# EAGLE design toyotune_3s_lvc2 (EAGLE 5.11)

## Sheet 1 of 4
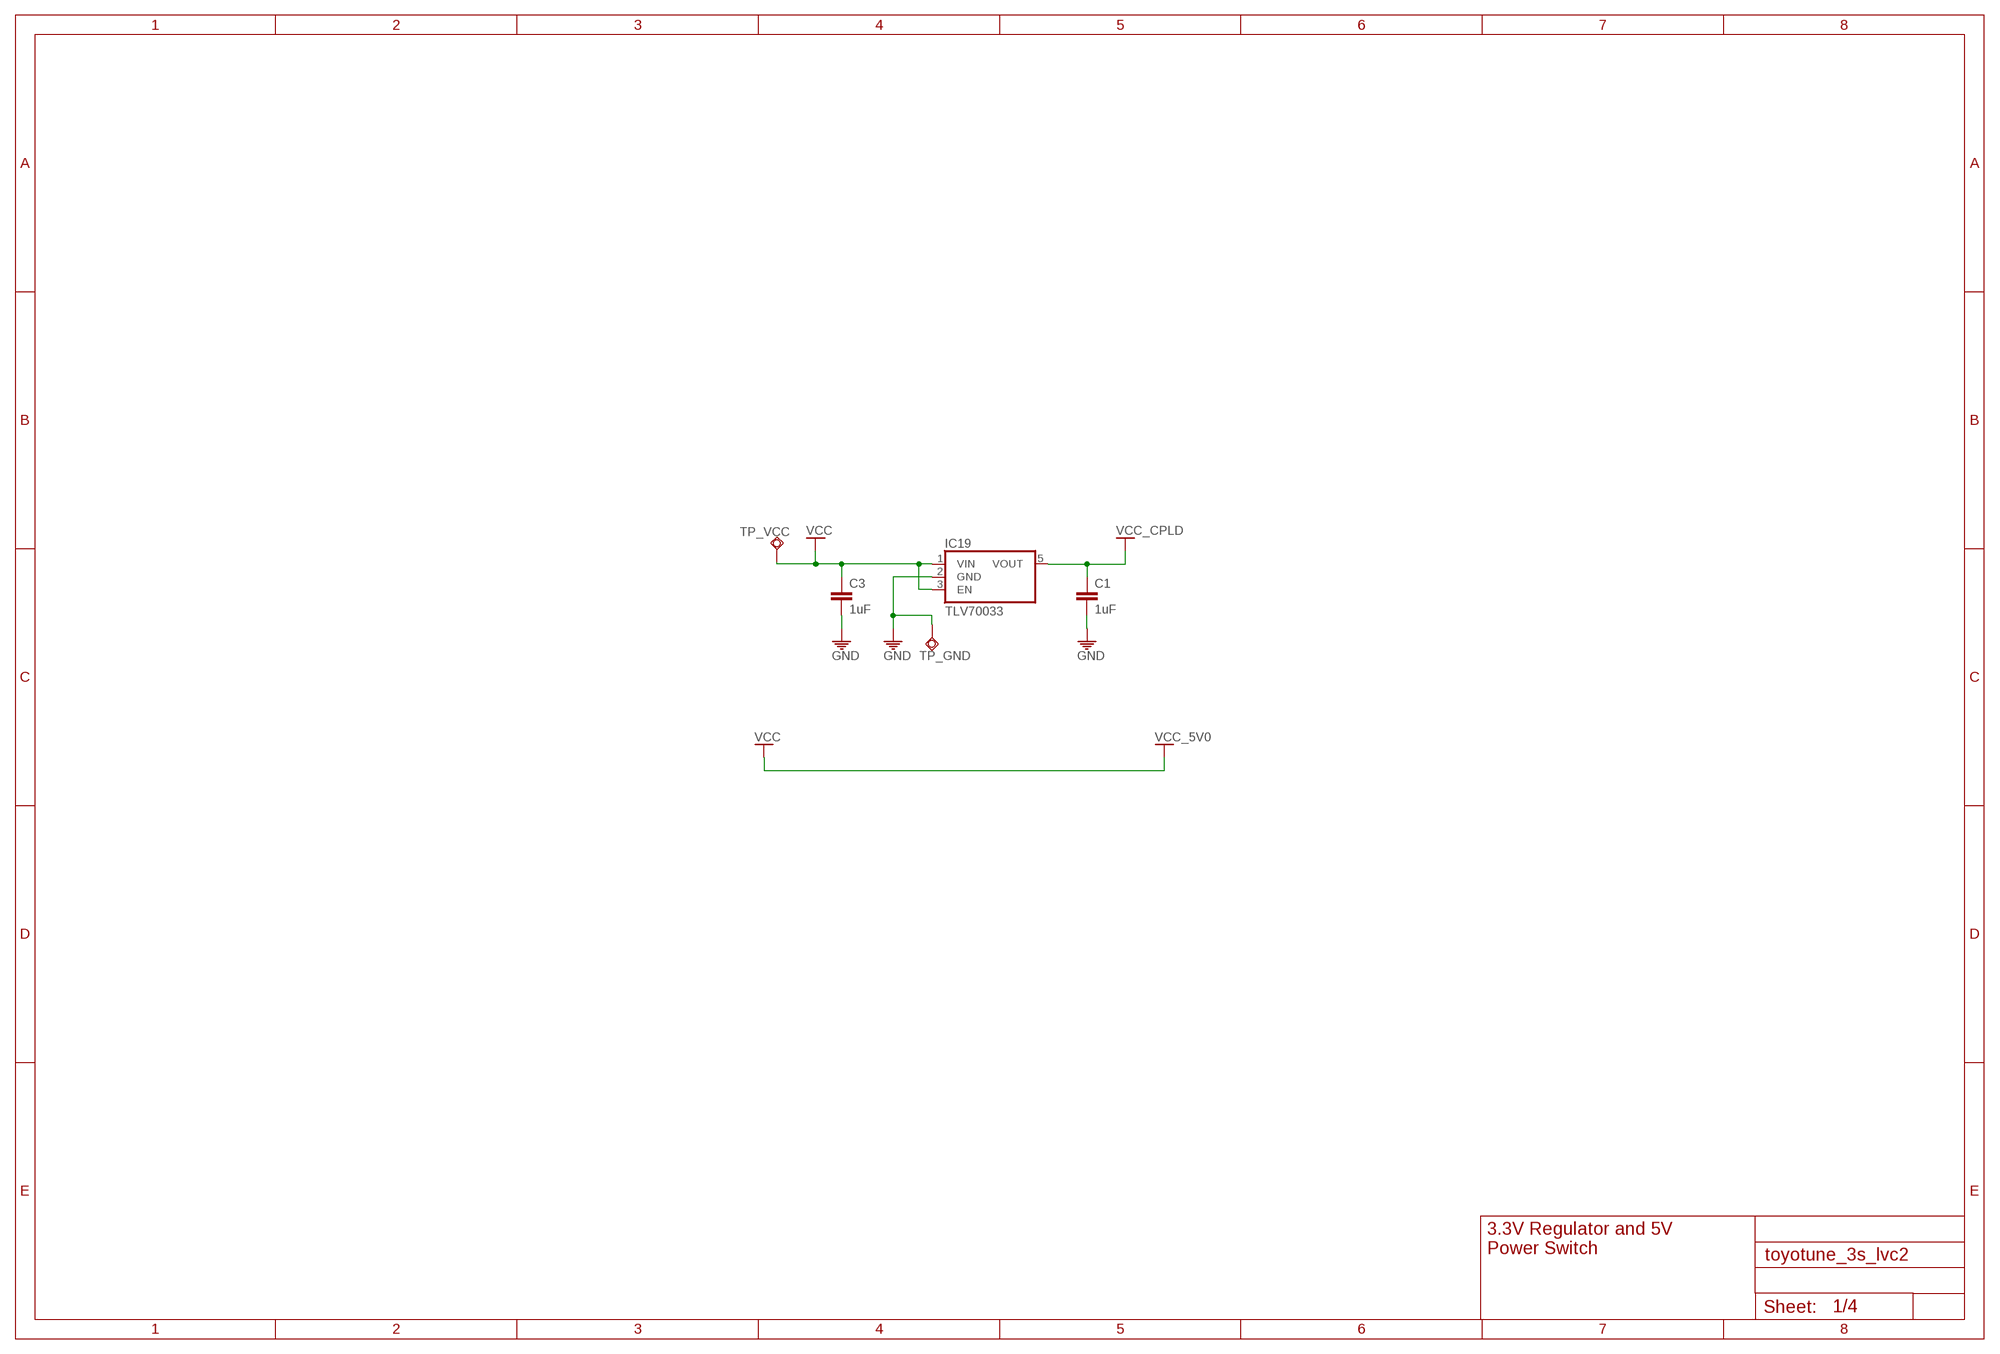
[diagram p0: schematic, sheet 1]

### Parts
C1  1uF  C-EUC0603  [C0603]
C3  1uF  C-EUC0603  [C0603]
IC19  TLV70033  [DDC_R-PDSO-G5]
TP_GND  TPSQTP12SQ  [TP12SQ]
TP_VCC  TPSQTP12SQ  [TP12SQ]

### Nets
GND: C1.2 C3.2 IC19.2(GND) TP_GND.TP ; also sheet 2,3,4
VCC: C3.1 IC19.1(VIN) IC19.3(EN) TP_VCC.TP ; supply symbol labelled VCC_5V0 ; also sheet 2,3,4
VCC_CPLD: C1.1 IC19.5(VOUT) ; also sheet 3,4

### Notes on the sheet
- 3.3V Regulator and 5V
- Power Switch

## Sheet 2 of 4
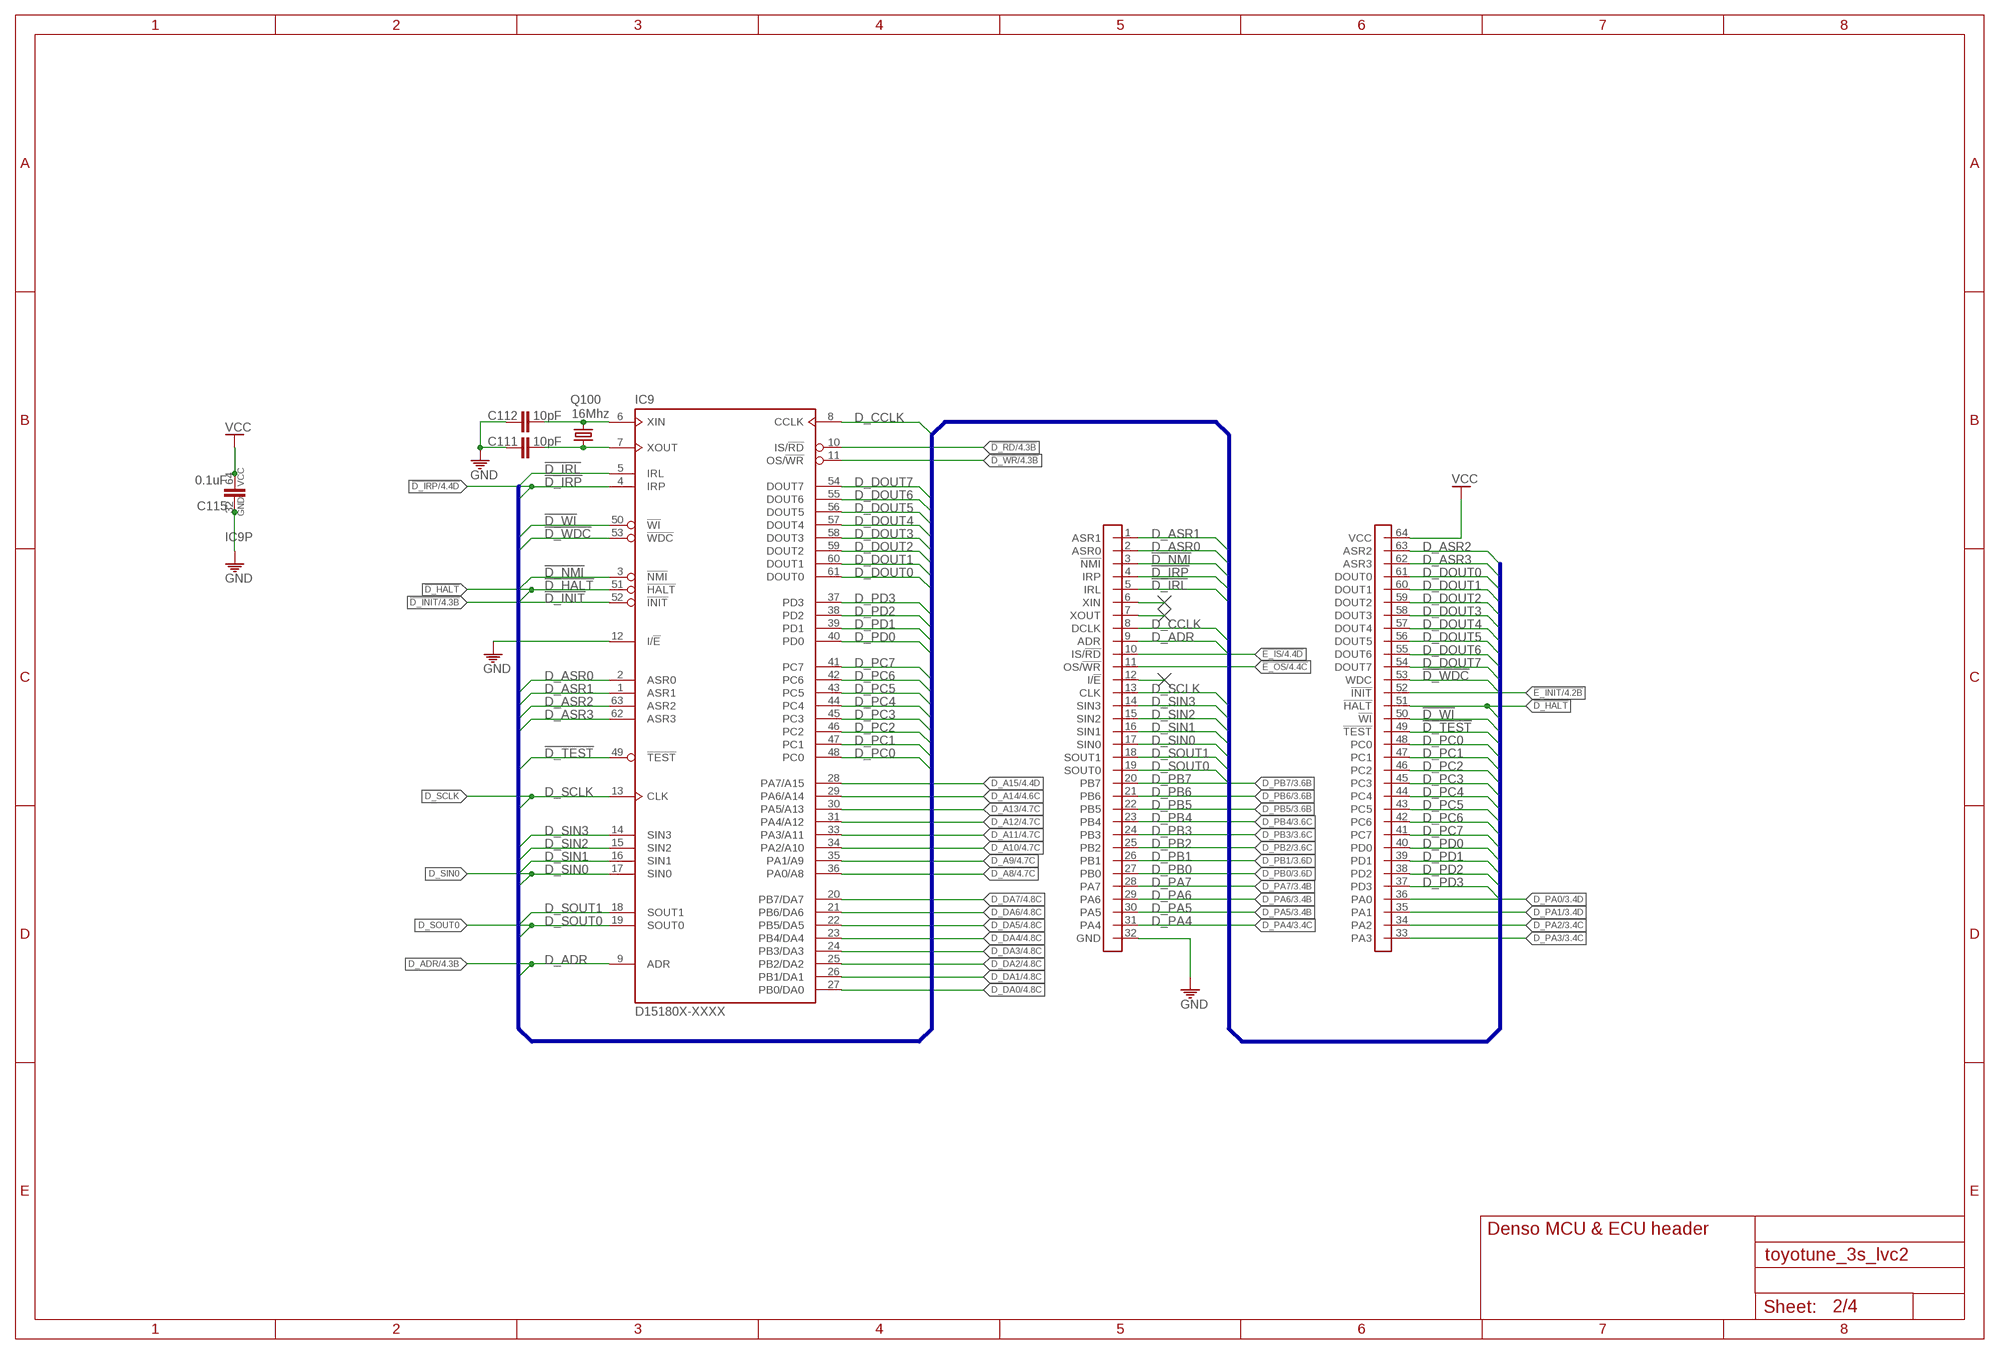
[diagram p1: schematic, sheet 2]

### Parts
C111  10pF  C-EUC0603  [C0603]
C112  10pF  C-EUC0603  [C0603]
C115  0.1uF  C-EUC0603  [C0603]
IC9  D15180X-XXXX  D151803-9661  [SDIP-64]
Q100  16Mhz  CRYSTAL5X3  [CRYSTAL-SMD-5X3]
U1  D151803-CONN  [SDIP-64-CONN]

### Nets
!D_HALT: IC9.51(:!HALT) U1.51(!HALT)
!D_INIT: IC9.52(:!INIT) ; also sheet 4
!D_IRL: IC9.5(:IRL) U1.5(IRL)
!D_IRP: IC9.4(:IRP) U1.4(IRP) ; also sheet 4
!D_NMI: IC9.3(:!NMI) U1.3(!NMI)
!D_RD: IC9.10(:IS/!RD) ; also sheet 4
!D_TEST: IC9.49(:!TEST) U1.49(!TEST)
!D_WDC: IC9.53(:!WDC) U1.53(WDC)
!D_WI: IC9.50(:!WI) U1.50(!WI)
!D_WR: IC9.11(:OS/!WR) ; also sheet 4
!E_INIT: U1.52(!INIT) ; also sheet 4
!E_IS: U1.10(IS/!RD) ; also sheet 4
!E_OS: U1.11(OS/!WR) ; also sheet 4
D1_XIN: C112.2 IC9.6(:XIN) Q100.3
D1_XOUT: C111.1 IC9.7(:XOUT) Q100.1
D_A8: IC9.36(:PA0/A8) ; also sheet 4
D_A9: IC9.35(:PA1/A9) ; also sheet 4
D_A10: IC9.34(:PA2/A10) ; also sheet 4
D_A11: IC9.33(:PA3/A11) ; also sheet 4
D_A12: IC9.31(:PA4/A12) ; also sheet 4
D_A13: IC9.30(:PA5/A13) ; also sheet 4
D_A14: IC9.29(:PA6/A14) ; also sheet 4
D_A15: IC9.28(:PA7/A15) ; also sheet 4
D_ADR: IC9.9(:ADR) U1.9(ADR) ; also sheet 4
D_ASR0: IC9.2(:ASR0) U1.2(ASR0)
D_ASR1: IC9.1(:ASR1) U1.1(ASR1)
D_ASR2: IC9.63(:ASR2) U1.63(ASR2)
D_ASR3: IC9.62(:ASR3) U1.62(ASR3)
D_CCLK: IC9.8(:CCLK) U1.8(DCLK) ; also sheet 4
D_DA0: IC9.27(:PB0/DA0) ; also sheet 4
D_DA1: IC9.26(:PB1/DA1) ; also sheet 4
D_DA2: IC9.25(:PB2/DA2) ; also sheet 4
D_DA3: IC9.24(:PB3/DA3) ; also sheet 4
D_DA4: IC9.23(:PB4/DA4) ; also sheet 4
D_DA5: IC9.22(:PB5/DA5) ; also sheet 4
D_DA6: IC9.21(:PB6/DA6) ; also sheet 4
D_DA7: IC9.20(:PB7/DA7) ; also sheet 4
D_DOUT0: IC9.61(:DOUT0) U1.61(DOUT0)
D_DOUT1: IC9.60(:DOUT1) U1.60(DOUT1)
D_DOUT2: IC9.59(:DOUT2) U1.59(DOUT2)
D_DOUT3: IC9.58(:DOUT3) U1.58(DOUT3)
D_DOUT4: IC9.57(:DOUT4) U1.57(DOUT4)
D_DOUT5: IC9.56(:DOUT5) U1.56(DOUT5)
D_DOUT6: IC9.55(:DOUT6) U1.55(DOUT6)
D_DOUT7: IC9.54(:DOUT7) U1.54(DOUT7)
D_PA0: U1.36(PA0) ; also sheet 3
D_PA1: U1.35(PA1) ; also sheet 3
D_PA2: U1.34(PA2) ; also sheet 3
D_PA3: U1.33(PA3) ; also sheet 3
D_PA4: U1.31(PA4) ; also sheet 3
D_PA5: U1.30(PA5) ; also sheet 3
D_PA6: U1.29(PA6) ; also sheet 3
D_PA7: U1.28(PA7) ; also sheet 3
D_PB0: U1.27(PB0) ; also sheet 3
D_PB1: U1.26(PB1) ; also sheet 3
D_PB2: U1.25(PB2) ; also sheet 3
D_PB3: U1.24(PB3) ; also sheet 3
D_PB4: U1.23(PB4) ; also sheet 3
D_PB5: U1.22(PB5) ; also sheet 3
D_PB6: U1.21(PB6) ; also sheet 3
D_PB7: U1.20(PB7) ; also sheet 3
D_PC0: IC9.48(:PC0) U1.48(PC0)
D_PC1: IC9.47(:PC1) U1.47(PC1)
D_PC2: IC9.46(:PC2) U1.46(PC2)
D_PC3: IC9.45(:PC3) U1.45(PC3)
D_PC4: IC9.44(:PC4) U1.44(PC4)
D_PC5: IC9.43(:PC5) U1.43(PC5)
D_PC6: IC9.42(:PC6) U1.42(PC6)
D_PC7: IC9.41(:PC7) U1.41(PC7)
D_PD0: IC9.40(:PD0) U1.40(PD0)
D_PD1: IC9.39(:PD1) U1.39(PD1)
D_PD2: IC9.38(:PD2) U1.38(PD2)
D_PD3: IC9.37(:PD3) U1.37(PD3)
D_SCLK: IC9.13(:CLK) U1.13(CLK)
D_SIN0: IC9.17(:SIN0) U1.17(SIN0)
D_SIN1: IC9.16(:SIN1) U1.16(SIN1)
D_SIN2: IC9.15(:SIN2) U1.15(SIN2)
D_SIN3: IC9.14(:SIN3) U1.14(SIN3)
D_SOUT0: IC9.19(:SOUT0) U1.19(SOUT0)
D_SOUT1: IC9.18(:SOUT1) U1.18(SOUT1)
GND: C111.2 C112.1 C115.1 IC9.12(:I/!E) IC9.32(P:GND) U1.32(GND) ; also sheet 1,3,4
N$28: U1.6(XIN)
N$29: U1.7(XOUT)
N$30: U1.12(I/!E)
VCC: C115.2 IC9.64(P:VCC) U1.64(VCC) ; also sheet 1,3,4

### Buses
!D_IRL,!D_IRP,!D_WI,!D_WDC,!D_NMI,!D_HALT,!D1_INIT,D_ASR[0..3],!D_TEST,D_PC[0..7],D_PD[0..3],D_ADR,D_SIN[0..3],D_SOUT[0..1],D_SCLK,D_CCLK,D_DOUT[0..7]

### Notes on the sheet
- Denso MCU & ECU header

## Sheet 3 of 4
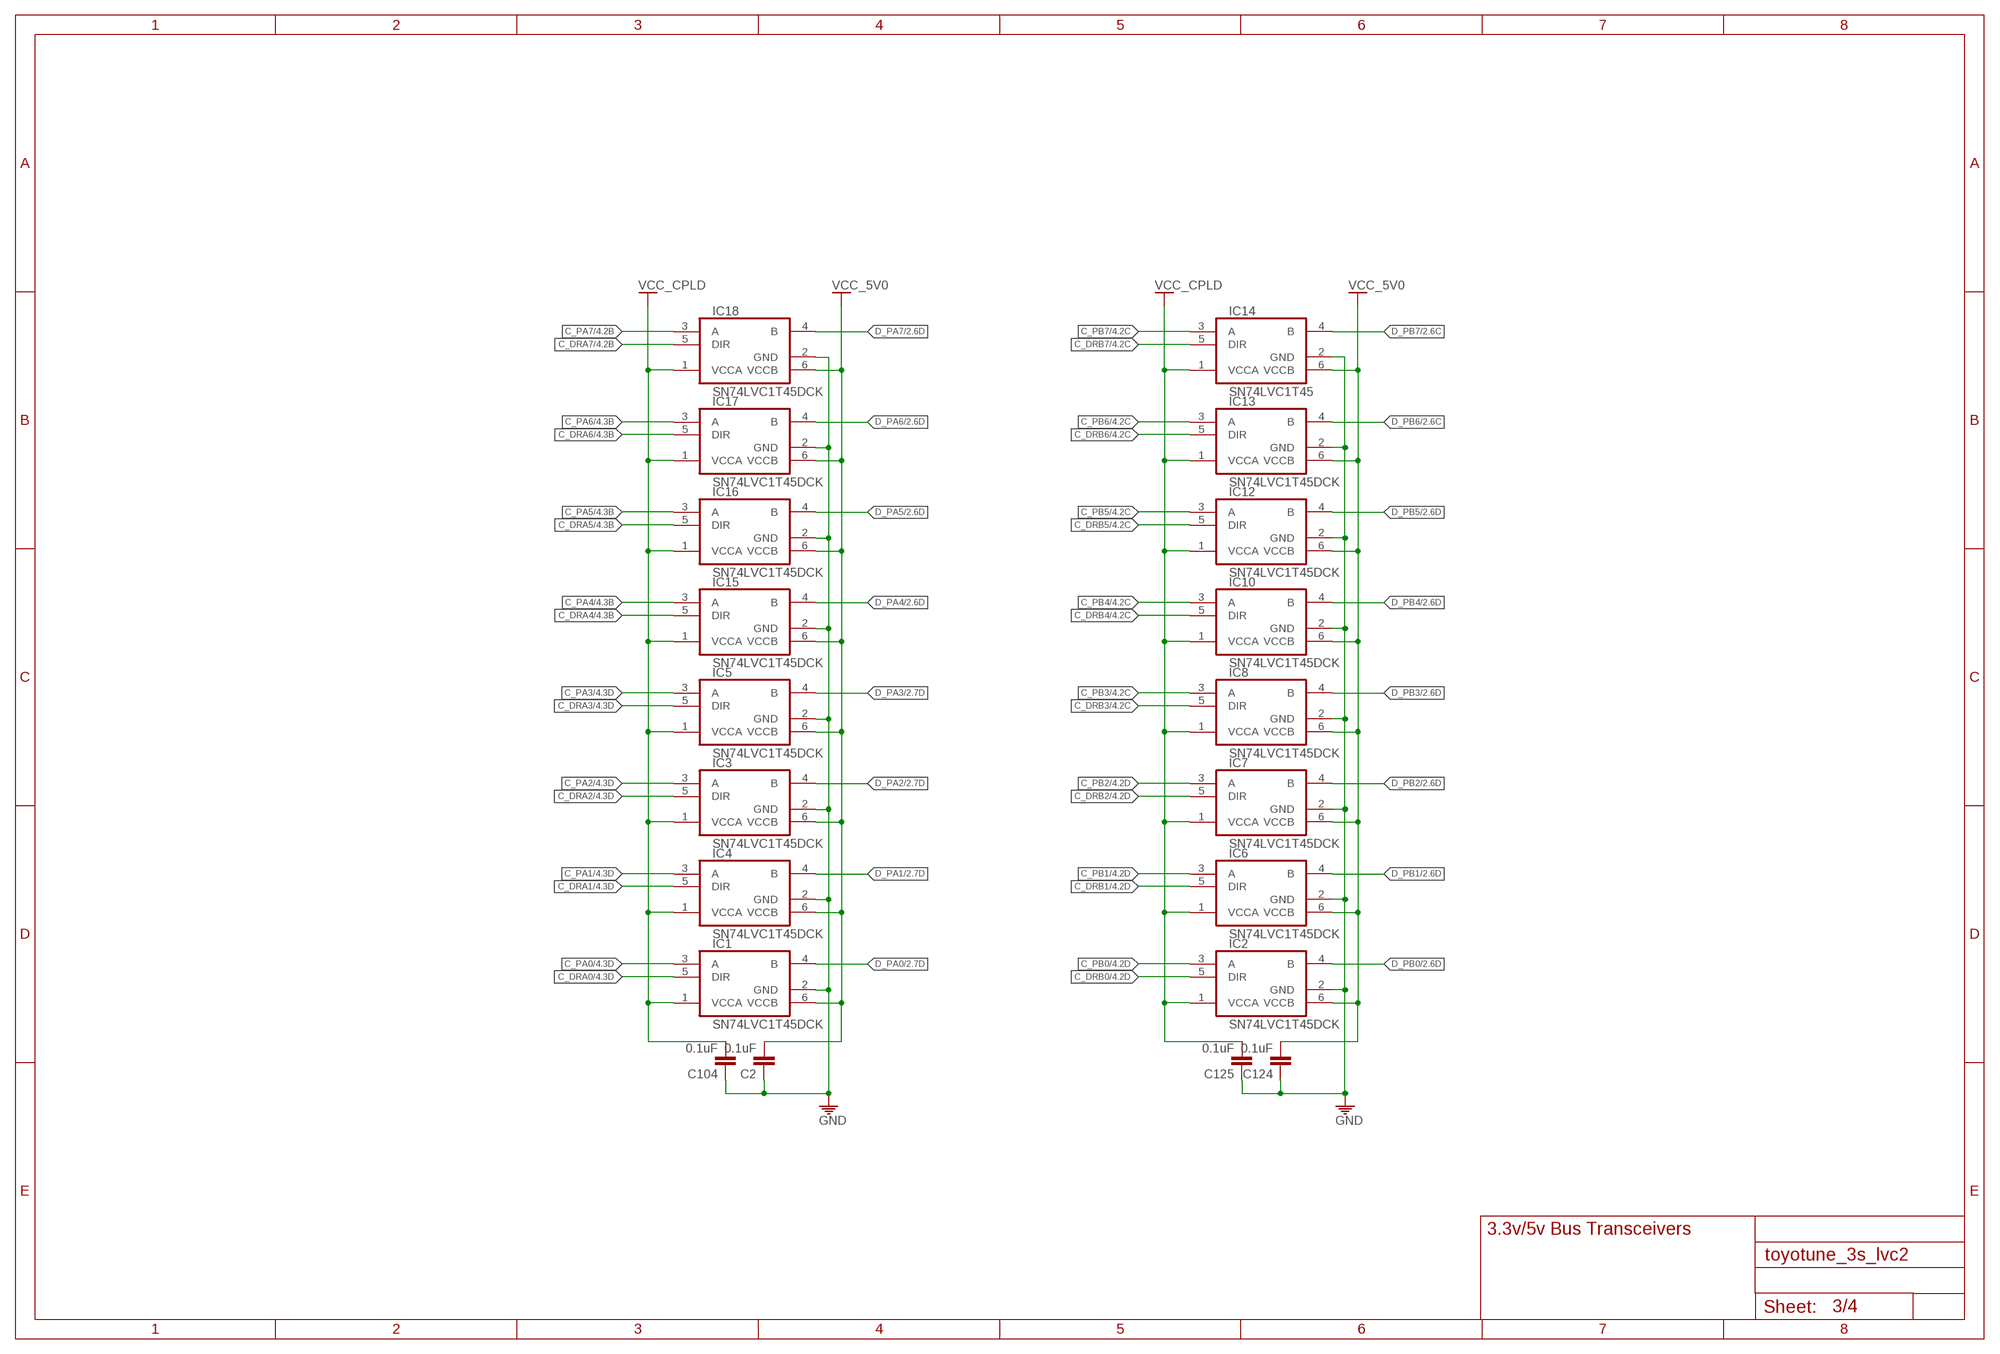
[diagram p2: schematic, sheet 3]

### Parts
C2  0.1uF  C-EUC0603  [C0603]
C104  0.1uF  C-EUC0603  [C0603]
C124  0.1uF  C-EUC0603  [C0603]
C125  0.1uF  C-EUC0603  [C0603]
IC1  SN74LVC1T45DCK  [DCK_R-PDSO-G6]
IC2  SN74LVC1T45DCK  [DCK_R-PDSO-G6]
IC3  SN74LVC1T45DCK  [DCK_R-PDSO-G6]
IC4  SN74LVC1T45DCK  [DCK_R-PDSO-G6]
IC5  SN74LVC1T45DCK  [DCK_R-PDSO-G6]
IC6  SN74LVC1T45DCK  [DCK_R-PDSO-G6]
IC7  SN74LVC1T45DCK  [DCK_R-PDSO-G6]
IC8  SN74LVC1T45DCK  [DCK_R-PDSO-G6]
IC10  SN74LVC1T45DCK  [DCK_R-PDSO-G6]
IC12  SN74LVC1T45DCK  [DCK_R-PDSO-G6]
IC13  SN74LVC1T45DCK  [DCK_R-PDSO-G6]
IC14  SN74LVC1T45  SN74LVC1T45DCK  [DCK_R-PDSO-G6]
IC15  SN74LVC1T45DCK  [DCK_R-PDSO-G6]
IC16  SN74LVC1T45DCK  [DCK_R-PDSO-G6]
IC17  SN74LVC1T45DCK  [DCK_R-PDSO-G6]
IC18  SN74LVC1T45DCK  [DCK_R-PDSO-G6]

### Nets
C_DRA0: IC1.5(DIR) ; also sheet 4
C_DRA1: IC4.5(DIR) ; also sheet 4
C_DRA2: IC3.5(DIR) ; also sheet 4
C_DRA3: IC5.5(DIR) ; also sheet 4
C_DRA4: IC15.5(DIR) ; also sheet 4
C_DRA5: IC16.5(DIR) ; also sheet 4
C_DRA6: IC17.5(DIR) ; also sheet 4
C_DRA7: IC18.5(DIR) ; also sheet 4
C_DRB0: IC2.5(DIR) ; also sheet 4
C_DRB1: IC6.5(DIR) ; also sheet 4
C_DRB2: IC7.5(DIR) ; also sheet 4
C_DRB3: IC8.5(DIR) ; also sheet 4
C_DRB4: IC10.5(DIR) ; also sheet 4
C_DRB5: IC12.5(DIR) ; also sheet 4
C_DRB6: IC13.5(DIR) ; also sheet 4
C_DRB7: IC14.5(DIR) ; also sheet 4
C_PA0: IC1.3(A) ; also sheet 4
C_PA1: IC4.3(A) ; also sheet 4
C_PA2: IC3.3(A) ; also sheet 4
C_PA3: IC5.3(A) ; also sheet 4
C_PA4: IC15.3(A) ; also sheet 4
C_PA5: IC16.3(A) ; also sheet 4
C_PA6: IC17.3(A) ; also sheet 4
C_PA7: IC18.3(A) ; also sheet 4
C_PB0: IC2.3(A) ; also sheet 4
C_PB1: IC6.3(A) ; also sheet 4
C_PB2: IC7.3(A) ; also sheet 4
C_PB3: IC8.3(A) ; also sheet 4
C_PB4: IC10.3(A) ; also sheet 4
C_PB5: IC12.3(A) ; also sheet 4
C_PB6: IC13.3(A) ; also sheet 4
C_PB7: IC14.3(A) ; also sheet 4
D_PA0: IC1.4(B) ; also sheet 2
D_PA1: IC4.4(B) ; also sheet 2
D_PA2: IC3.4(B) ; also sheet 2
D_PA3: IC5.4(B) ; also sheet 2
D_PA4: IC15.4(B) ; also sheet 2
D_PA5: IC16.4(B) ; also sheet 2
D_PA6: IC17.4(B) ; also sheet 2
D_PA7: IC18.4(B) ; also sheet 2
D_PB0: IC2.4(B) ; also sheet 2
D_PB1: IC6.4(B) ; also sheet 2
D_PB2: IC7.4(B) ; also sheet 2
D_PB3: IC8.4(B) ; also sheet 2
D_PB4: IC10.4(B) ; also sheet 2
D_PB5: IC12.4(B) ; also sheet 2
D_PB6: IC13.4(B) ; also sheet 2
D_PB7: IC14.4(B) ; also sheet 2
GND: C2.1 C104.1 C124.1 C125.1 IC1.2(GND) IC2.2(GND) IC3.2(GND) IC4.2(GND) IC5.2(GND) IC6.2(GND) IC7.2(GND) IC8.2(GND) IC10.2(GND) IC12.2(GND) IC13.2(GND) IC14.2(GND) IC15.2(GND) IC16.2(GND) IC17.2(GND) IC18.2(GND) ; also sheet 1,2,4
VCC: C2.2 C124.2 IC1.6(VCCB) IC2.6(VCCB) IC3.6(VCCB) IC4.6(VCCB) IC5.6(VCCB) IC6.6(VCCB) IC7.6(VCCB) IC8.6(VCCB) IC10.6(VCCB) IC12.6(VCCB) IC13.6(VCCB) IC14.6(VCCB) IC15.6(VCCB) IC16.6(VCCB) IC17.6(VCCB) IC18.6(VCCB) ; supply symbol labelled VCC_5V0 ; also sheet 1,2,4
VCC_CPLD: C104.2 C125.2 IC1.1(VCCA) IC2.1(VCCA) IC3.1(VCCA) IC4.1(VCCA) IC5.1(VCCA) IC6.1(VCCA) IC7.1(VCCA) IC8.1(VCCA) IC10.1(VCCA) IC12.1(VCCA) IC13.1(VCCA) IC14.1(VCCA) IC15.1(VCCA) IC16.1(VCCA) IC17.1(VCCA) IC18.1(VCCA) ; also sheet 1,4

### Notes on the sheet
- 3.3v/5v Bus Transceivers

## Sheet 4 of 4
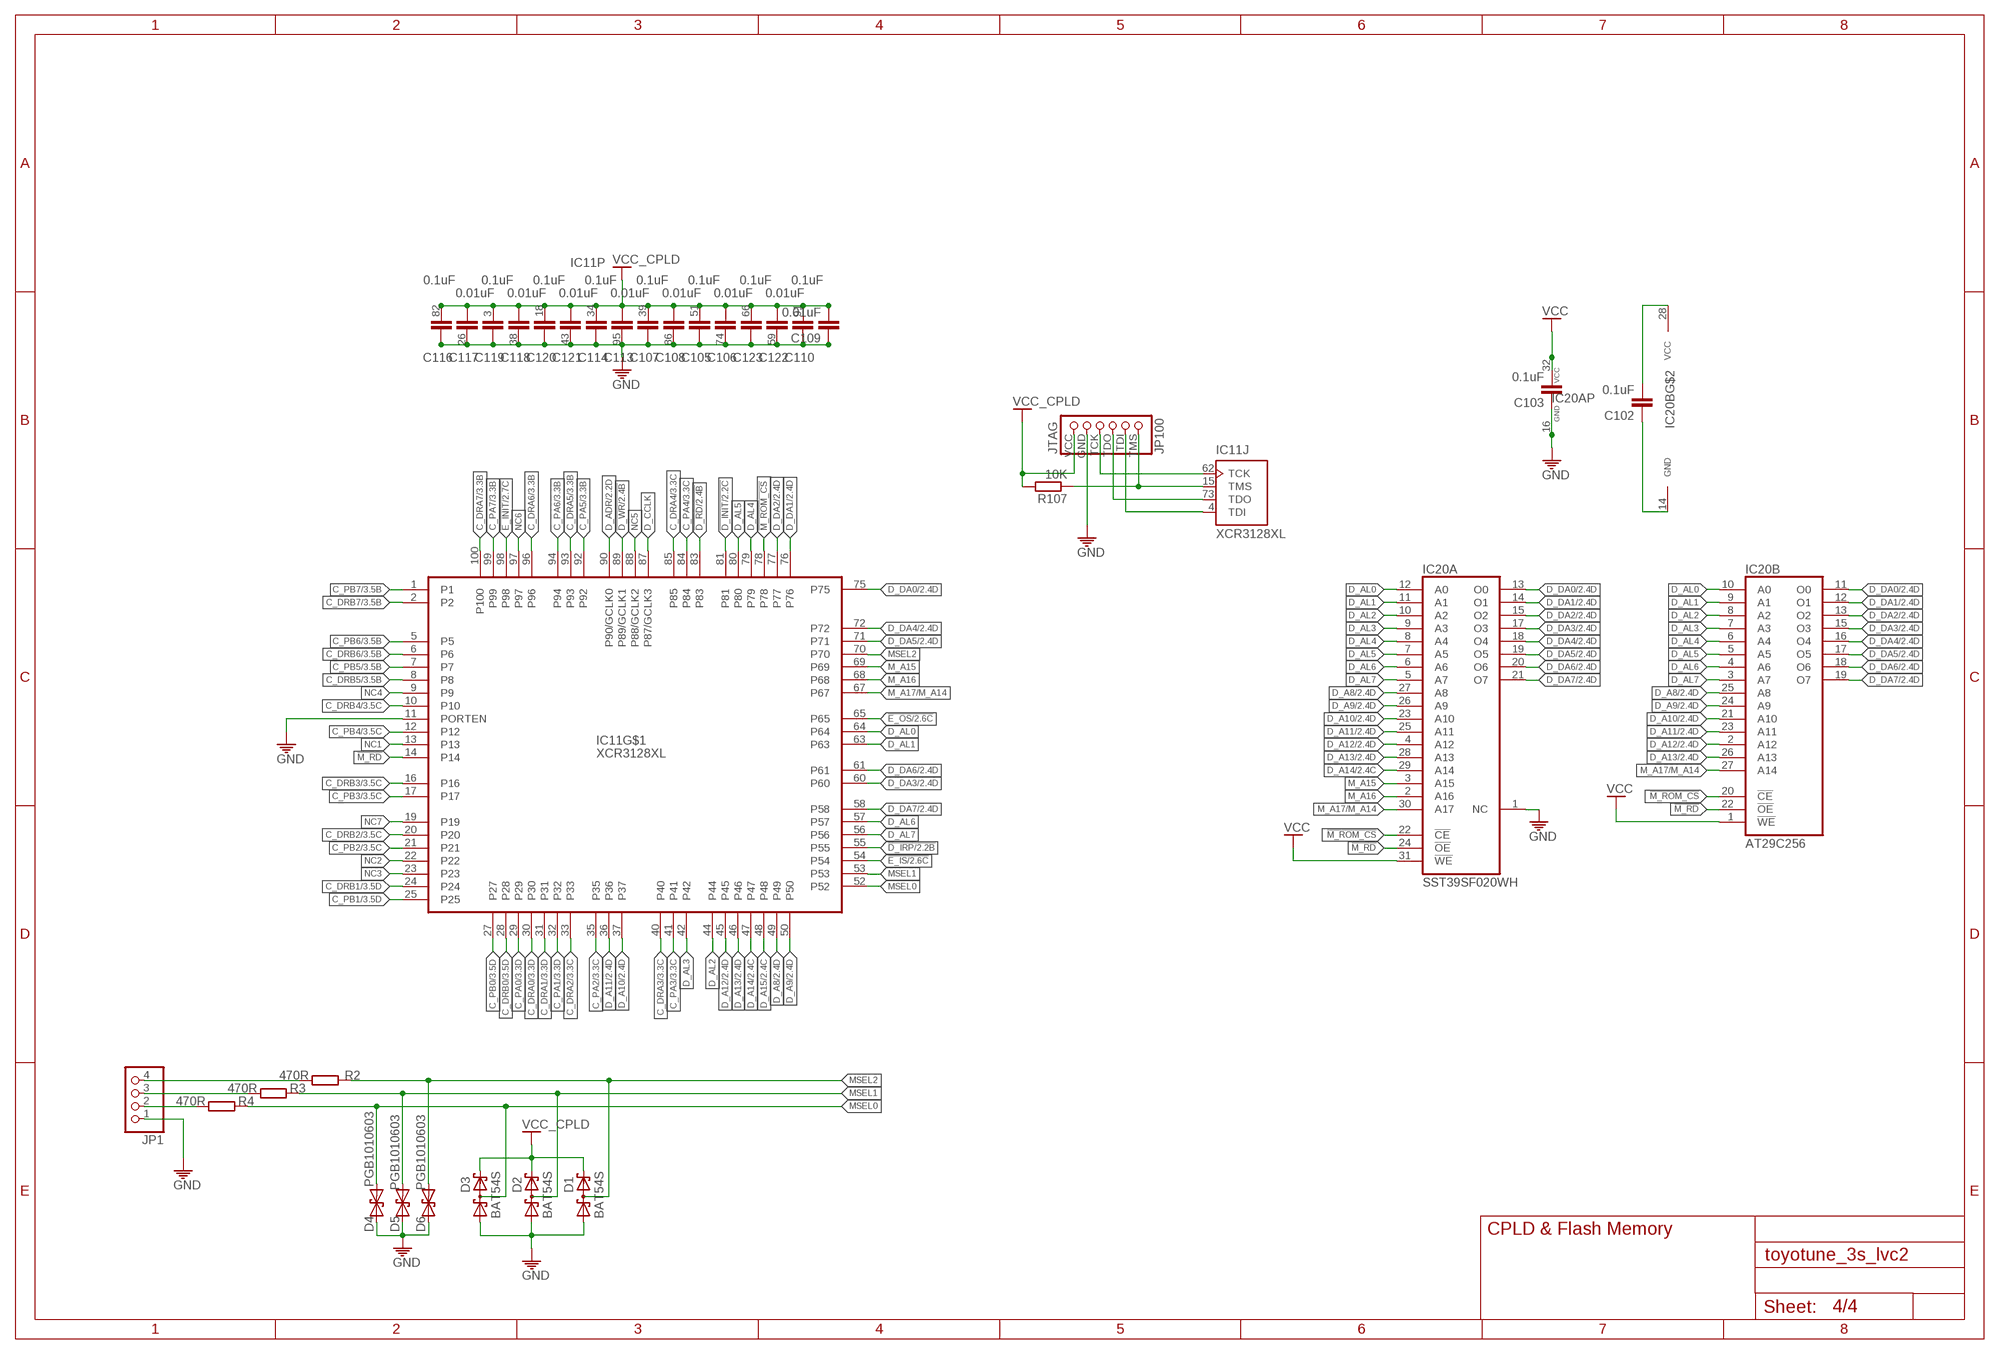
[diagram p3: schematic, sheet 4]

### Parts
C102  0.1uF  C-EUC0603  [C0603]
C103  0.1uF  C-EUC0603  [C0603]
C105  0.1uF  C-EUC0603  [C0603]
C106  0.01uF  C-EUC0603  [C0603]
C107  0.1uF  C-EUC0603  [C0603]
C108  0.01uF  C-EUC0603  [C0603]
C109  0.01uF  C-EUC0603  [C0603]
C110  0.1uF  C-EUC0603  [C0603]
C113  0.01uF  C-EUC0603  [C0603]
C114  0.1uF  C-EUC0603  [C0603]
C116  0.1uF  C-EUC0603  [C0603]
C117  0.01uF  C-EUC0603  [C0603]
C118  0.01uF  C-EUC0603  [C0603]
C119  0.1uF  C-EUC0603  [C0603]
C120  0.1uF  C-EUC0603  [C0603]
C121  0.01uF  C-EUC0603  [C0603]
C122  0.01uF  C-EUC0603  [C0603]
C123  0.1uF  C-EUC0603  [C0603]
D1  BAT54S  [SOT23]
D2  BAT54S  [SOT23]
D3  BAT54S  [SOT23]
D4  PGB1010603  [R0603]
D5  PGB1010603  [R0603]
D6  PGB1010603  [R0603]
IC11  XCR3128XL  [VQ100]
IC20A  SST39SF020WH  SST39VF020NH2  [S32]
IC20B  AT29C256  [PDIP28]
JP1  PINHD-1X4  [1X04]
JP100  JTAG  JTAG_HEADERS  [1X06_SMD]
R2  470R  R-EU_R0603  [R0603]
R3  470R  R-EU_R0603  [R0603]
R4  470R  R-EU_R0603  [R0603]
R107  10K  R-EU_R0603  [R0603]

### Nets
!D_INIT: IC11.81 ; also sheet 2
!D_IRP: IC11.55 ; also sheet 2
!D_RD: IC11.83 ; also sheet 2
!D_WR: IC11.89(P89/GCLK1) ; also sheet 2
!E_INIT: IC11.98 ; also sheet 2
!E_IS: IC11.54 ; also sheet 2
!E_OS: IC11.65 ; also sheet 2
!M_RD: IC11.14 IC20A.24(!OE) IC20B.22(!OE)
!M_ROM_CS: IC11.78 IC20A.22(!CE) IC20B.20(!CE)
C_DRA0: IC11.30 ; also sheet 3
C_DRA1: IC11.31 ; also sheet 3
C_DRA2: IC11.33 ; also sheet 3
C_DRA3: IC11.40 ; also sheet 3
C_DRA4: IC11.85 ; also sheet 3
C_DRA5: IC11.93 ; also sheet 3
C_DRA6: IC11.96 ; also sheet 3
C_DRA7: IC11.100 ; also sheet 3
C_DRB0: IC11.28 ; also sheet 3
C_DRB1: IC11.24 ; also sheet 3
C_DRB2: IC11.20 ; also sheet 3
C_DRB3: IC11.16 ; also sheet 3
C_DRB4: IC11.10 ; also sheet 3
C_DRB5: IC11.8 ; also sheet 3
C_DRB6: IC11.6 ; also sheet 3
C_DRB7: IC11.2 ; also sheet 3
C_PA0: IC11.29 ; also sheet 3
C_PA1: IC11.32 ; also sheet 3
C_PA2: IC11.35 ; also sheet 3
C_PA3: IC11.41 ; also sheet 3
C_PA4: IC11.84 ; also sheet 3
C_PA5: IC11.92 ; also sheet 3
C_PA6: IC11.94 ; also sheet 3
C_PA7: IC11.99 ; also sheet 3
C_PB0: IC11.27 ; also sheet 3
C_PB1: IC11.25 ; also sheet 3
C_PB2: IC11.21 ; also sheet 3
C_PB3: IC11.17 ; also sheet 3
C_PB4: IC11.12 ; also sheet 3
C_PB5: IC11.7 ; also sheet 3
C_PB6: IC11.5 ; also sheet 3
C_PB7: IC11.1 ; also sheet 3
D_A8: IC11.49 IC20A.27(A8) IC20B.25(A8) ; also sheet 2
D_A9: IC11.50 IC20A.26(A9) IC20B.24(A9) ; also sheet 2
D_A10: IC11.37 IC20A.23(A10) IC20B.21(A10) ; also sheet 2
D_A11: IC11.36 IC20A.25(A11) IC20B.23(A11) ; also sheet 2
D_A12: IC11.45 IC20A.4(A12) IC20B.2(A12) ; also sheet 2
D_A13: IC11.46 IC20A.28(A13) IC20B.26(A13) ; also sheet 2
D_A14: IC11.47 IC20A.29(A14) ; also sheet 2
D_A15: IC11.48 ; also sheet 2
D_ADR: IC11.90(P90/GCLK0) ; also sheet 2
D_AL0: IC11.64 IC20A.12(A0) IC20B.10(A0)
D_AL1: IC11.63 IC20A.11(A1) IC20B.9(A1)
D_AL2: IC11.44 IC20A.10(A2) IC20B.8(A2)
D_AL3: IC11.42 IC20A.9(A3) IC20B.7(A3)
D_AL4: IC11.79 IC20A.8(A4) IC20B.6(A4)
D_AL5: IC11.80 IC20A.7(A5) IC20B.5(A5)
D_AL6: IC11.57 IC20A.6(A6) IC20B.4(A6)
D_AL7: IC11.56 IC20A.5(A7) IC20B.3(A7)
D_CCLK: IC11.87(P87/GCLK3) ; also sheet 2
D_DA0: IC11.75 IC20A.13(O0) IC20B.11(O0) ; also sheet 2
D_DA1: IC11.76 IC20A.14(O1) IC20B.12(O1) ; also sheet 2
D_DA2: IC11.77 IC20A.15(O2) IC20B.13(O2) ; also sheet 2
D_DA3: IC11.60 IC20A.17(O3) IC20B.15(O3) ; also sheet 2
D_DA4: IC11.72 IC20A.18(O4) IC20B.16(O4) ; also sheet 2
D_DA5: IC11.71 IC20A.19(O5) IC20B.17(O5) ; also sheet 2
D_DA6: IC11.61 IC20A.20(O6) IC20B.18(O6) ; also sheet 2
D_DA7: IC11.58 IC20A.21(O7) IC20B.19(O7) ; also sheet 2
GND: C102.1 C103.1 C105.1 C106.1 C107.1 C108.1 C109.1 C110.1 C113.1 C114.1 C116.1 C117.1 C118.1 C119.1 C120.1 C121.1 C122.1 C123.1 D1.1(A1) D2.1(A1) D3.1(A1) D4.1 D5.1 D6.1 IC11.11(PORTEN) IC11.26(P:GND) IC11.38(P:GND) IC11.43(P:GND) IC11.59(P:GND) IC11.74(P:GND) IC11.86(P:GND) IC11.95(P:GND) IC20A.1(NC) IC20A.16(GND) IC20B.14(GND) JP1.1 JP100.GND ; also sheet 1,2,3
M_A15: IC11.69 IC20A.3(A15)
M_A16: IC11.68 IC20A.2(A16)
M_A17/M_A14: IC11.67 IC20A.30(A17) IC20B.27(A14)
MSEL0: D3.3(C1A2) D4.2 IC11.52 R4.1
MSEL0_ECU: JP1.2 R4.2
MSEL1: D2.3(C1A2) D5.2 IC11.53 R3.1
MSEL1_ECU: JP1.3 R3.2
MSEL2: D1.3(C1A2) D6.2 IC11.70 R2.1
MSEL2_ECU: JP1.4 R2.2
NC1: IC11.13
NC2: IC11.22
NC3: IC11.23
NC4: IC11.9
NC5: IC11.88(P88/GCLK2)
NC6: IC11.97
NC7: IC11.19
TCK: IC11.62(J:TCK) JP100.TCK
TDI: IC11.4(J:TDI) JP100.TDI
TDO: IC11.73(J:TDO) JP100.TDO
TMS: IC11.15(J:TMS) JP100.TMS R107.1
VCC: C102.2 C103.2 IC20A.31(!WE) IC20A.32(VCC) IC20B.1(!WE) IC20B.28(VCC) ; also sheet 1,2,3
VCC_CPLD: C105.2 C106.2 C107.2 C108.2 C109.2 C110.2 C113.2 C114.2 C116.2 C117.2 C118.2 C119.2 C120.2 C121.2 C122.2 C123.2 D1.2(C2) D2.2(C2) D3.2(C2) IC11.3(P:VCC_3V3) IC11.18(P:VCC_3V3) IC11.34(P:VCC_3V3) IC11.39(P:VCC_3V3) IC11.51(P:VCC_3V3) IC11.66(P:VCC_3V3) IC11.82(P:VCC_3V3) IC11.91(P:VCC_3V3) JP100.VCC R107.2 ; also sheet 1,3

### Notes on the sheet
- CPLD & Flash Memory

## Library data of the parts
C1-C3 C102-C125 = toyotune:C-EU: CAPACITOR, European symbol
D1-D3 = toyotune:BAT54S: Schottky Diodes Source: Fairchild .. BAT54.pdf
D4-D6 = toyotune:PGB1010603
IC1-IC8 IC10 IC12-IC18 = toyotune:SN74LVC1T45
IC9 = toyota-ecu:D151803-9661
IC11 = toyota-ecu:XCR3128XL
IC19 = toyota-ecu:TLV70033
IC20A = toyotune:SST39VF020: 2-Megabit FLASH MEMORY (256 K x 8 bit) 2.7-3.6 V
IC20B = toyotune:AT29C256
JP1 = toyotune:PINHD-1X4: PIN HEADER
JP100 = toyotune:JTAG_HEADER: PIN HEADER
Q100 = toyota-ecu:CRYSTAL: Crystals Various standard crystals. Proven footprints. Spark Fun Electronics SKU : COM-00534
R2-R4 R107 = toyotune:R-EU_: RESISTOR, European symbol
TP_GND TP_VCC = testpad:TPSQ: Test pad
U1 = toyotune:D151803-CONN

## Board
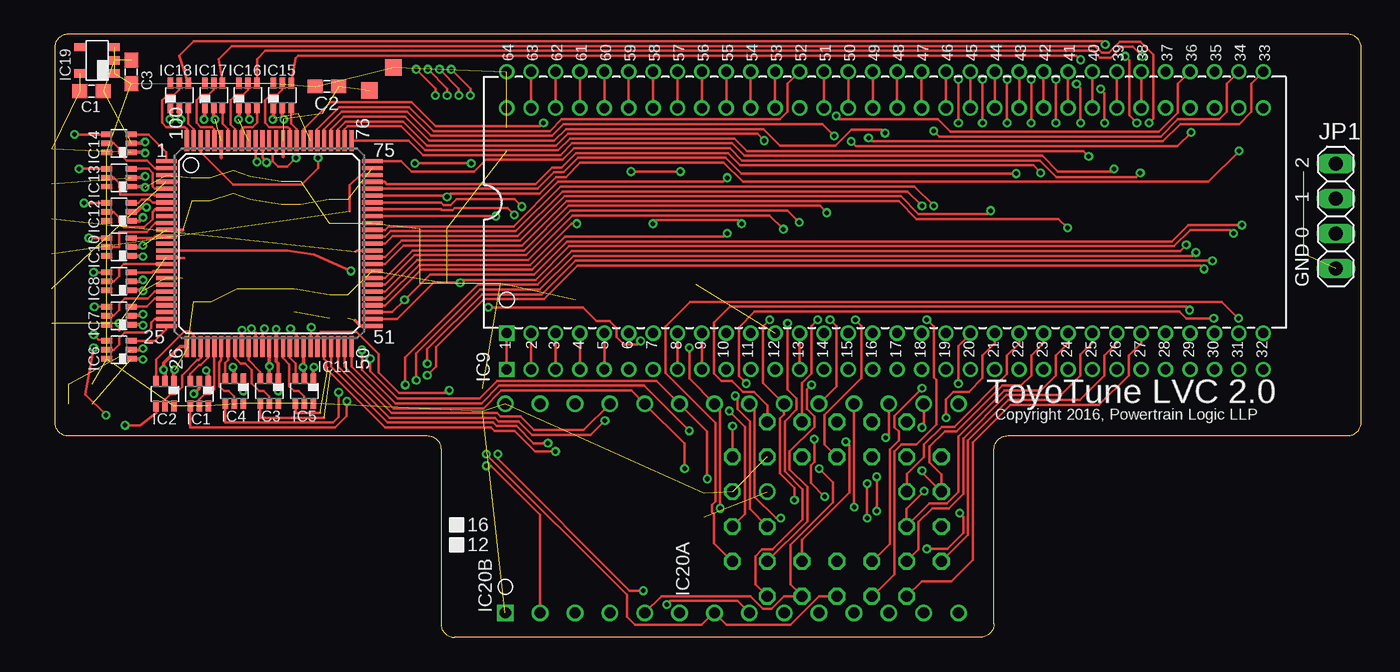
[diagram p4: board, top side]
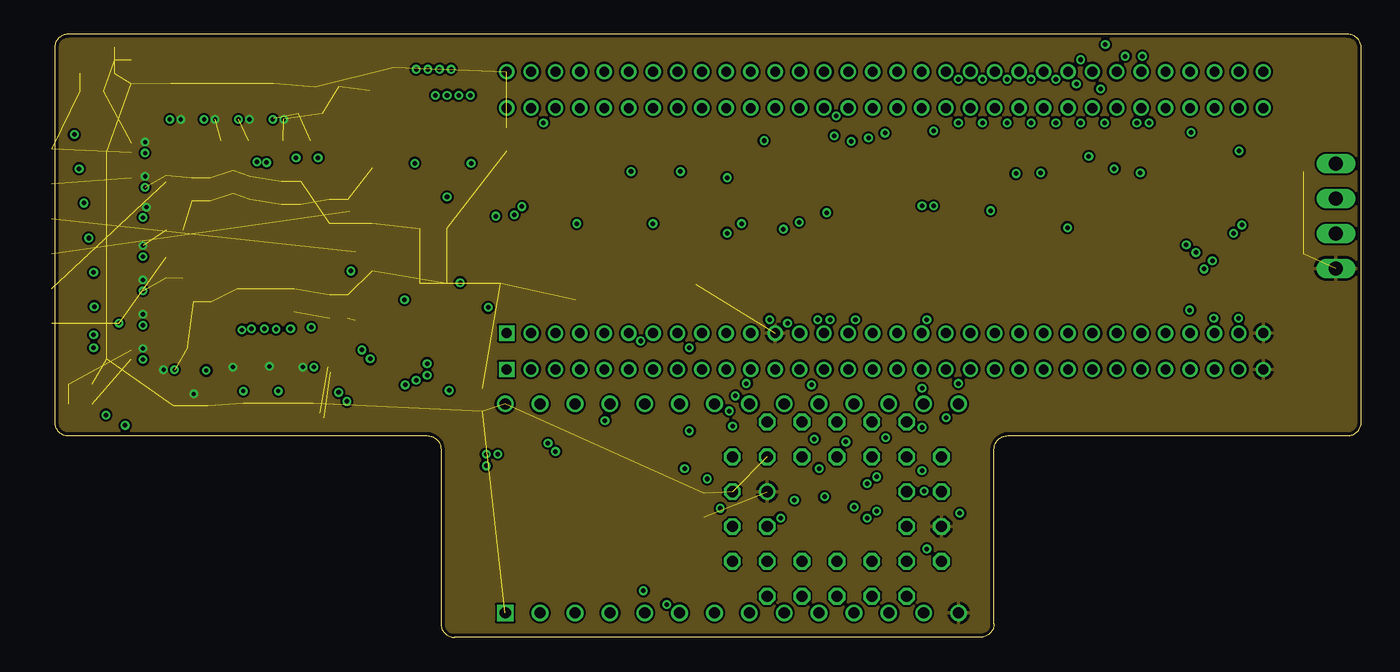
[diagram p5: board, inner layer GND]
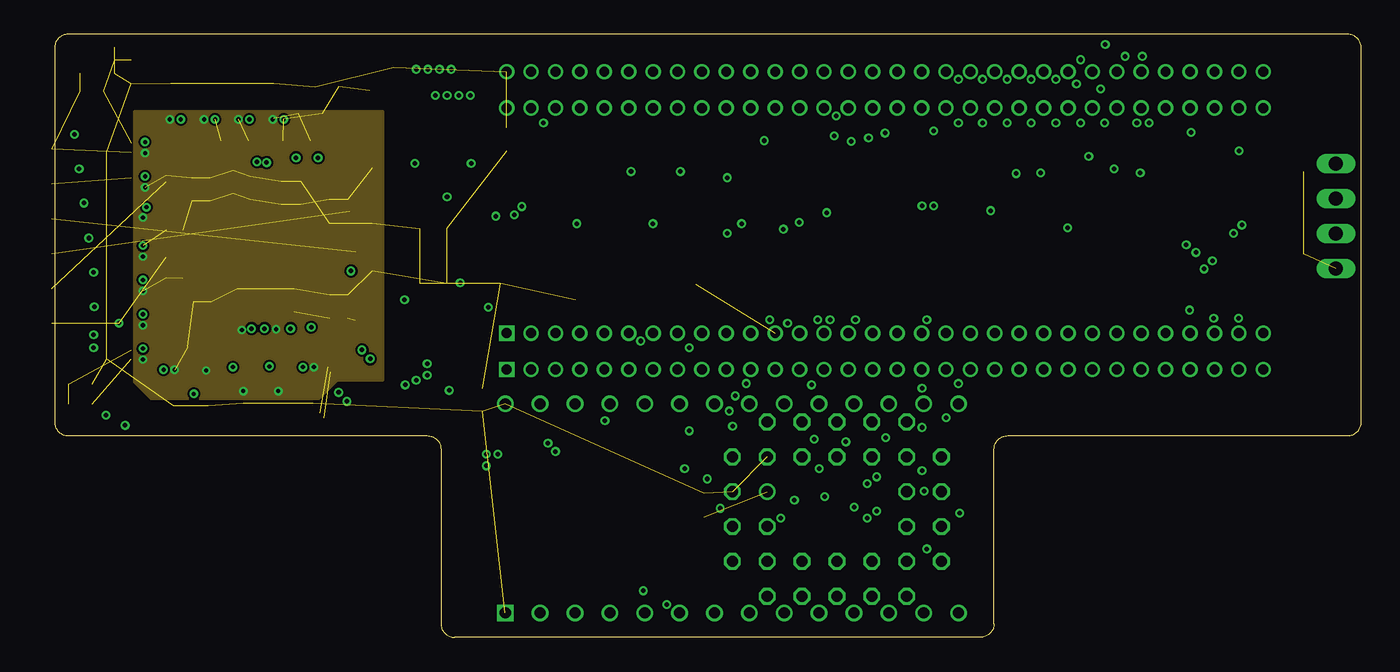
[diagram p6: board, inner layer Supply]
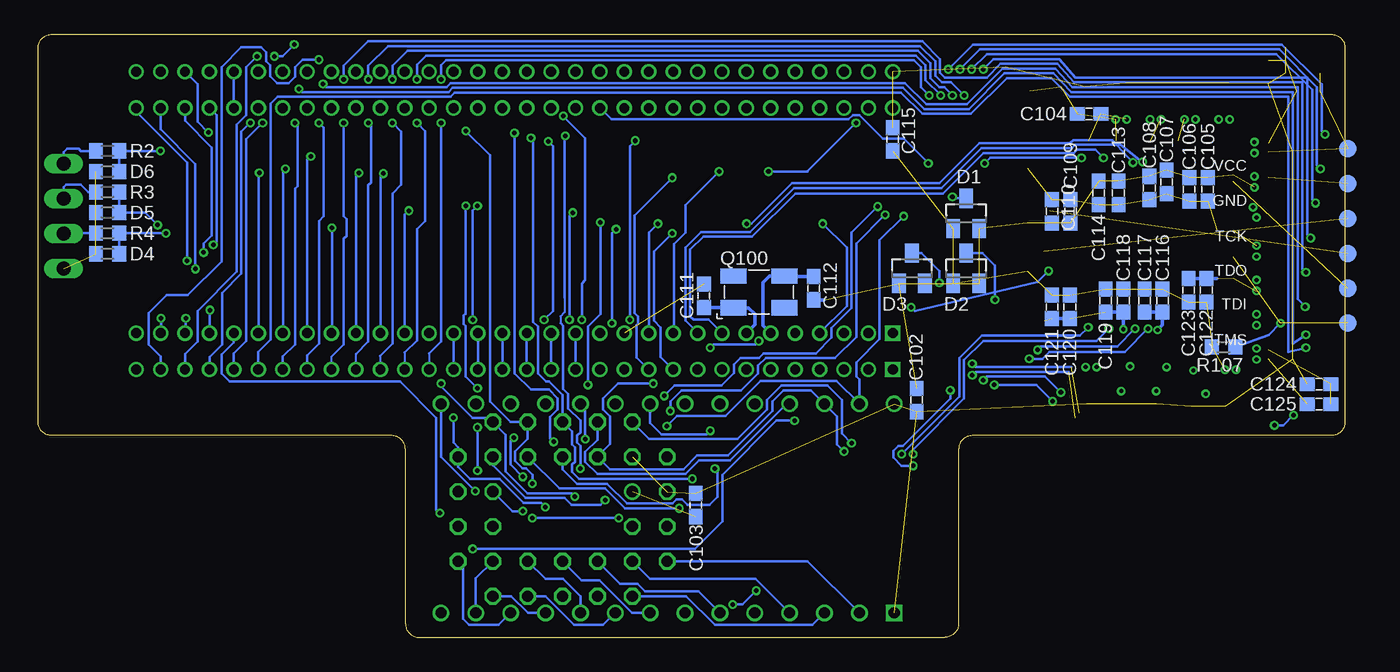
[diagram p7: board, bottom side, seen from below]

Size 95.2 x 43.95 mm. Coordinates in mm from the lower left corner, seen from the top.
Outline: 28.15,1 arc90 29.15,0 67.45,0 arc90 68.45,1 68.45,13.7 arc-90 69.45,14.7 94.2,14.7 arc90 95.2,15.7 95.2,42.95 arc90 94.2,43.95 1,43.95 arc90 0,42.95 0,15.7 arc90 1,14.7 27.15,14.7 arc-90 28.15,13.7 28.15,1
Copper layers (1*16): Top 0.035mm / dielectric 1.5mm / Bottom 0.035mm
Design rules "pcbway *": minimum track width 0.15mm, minimum drill 0.3mm, track to track 6mil, track to pad 6mil, pad to pad 6mil, via to via 6mil, smd to smd 0mil, copper to edge 10mil, drill to drill 10mil, minimum pad ring 8mil, minimum via ring 6mil, stop-mask expansion 2mil, vias tented up to drill 100mil, thermal gap 8mil

### Footprints (pad centres in the part's own frame; a part is rotated, then mirrored left to right if it is on the bottom)
C0603 = smd 1.1 x 1: 1 -0.85,0; 2 0.85,0
SOT23 = smd 1 x 1.4: 1 -0.95,-1.1; 2 0.95,-1.1; 3 0,1.1
R0603 = smd 1 x 1.1: 1 -0.85,0; 2 0.85,0
DCK_R-PDSO-G6 = smd 0.4 x 0.8: 1 -0.65,-0.9; 2 0,-0.9; 3 0.65,-0.9; 4 0.65,0.9; 5 0,0.9; 6 -0.65,0.9
SDIP-64 = drill 0.711 square: 1 -27.559,-9.525 | drill 0.711: 2 -25.781,-9.525; 3 -24.003,-9.525; 4 -22.225,-9.525; 5 -20.447,-9.525; 6 -18.669,-9.525; 7 -16.891,-9.525; 8 -15.113,-9.525; 9 -13.335,-9.525; 10 -11.557,-9.525; 11 -9.779,-9.525; 12 -8.001,-9.525; 13 -6.223,-9.525; 14 -4.445,-9.525; 15 -2.667,-9.525; 16 -0.889,-9.525; 17 0.889,-9.525; 18 2.667,-9.525; 19 4.445,-9.525; 20 6.223,-9.525; 21 8.001,-9.525; 22 9.779,-9.525; 23 11.557,-9.525; 24 13.335,-9.525; 25 15.113,-9.525; 26 16.891,-9.525; 27 18.669,-9.525; 28 20.447,-9.525; 29 22.225,-9.525; 30 24.003,-9.525; 31 25.781,-9.525; 32 27.559,-9.525; 33 27.559,9.525; 34 25.781,9.525; 35 24.003,9.525; 36 22.225,9.525; 37 20.447,9.525; 38 18.669,9.525; 39 16.891,9.525; 40 15.113,9.525; 41 13.335,9.525; 42 11.557,9.525; 43 9.779,9.525; 44 8.001,9.525; 45 6.223,9.525; 46 4.445,9.525; 47 2.667,9.525; 48 0.889,9.525; 49 -0.889,9.525; 50 -2.667,9.525; 51 -4.445,9.525; 52 -6.223,9.525; 53 -8.001,9.525; 54 -9.779,9.525; 55 -11.557,9.525; 56 -13.335,9.525; 57 -15.113,9.525; 58 -16.891,9.525; 59 -18.669,9.525; 60 -20.447,9.525; 61 -22.225,9.525; 62 -24.003,9.525; 63 -25.781,9.525; 64 -27.559,9.525
VQ100 = smd 1.5 x 0.3: 1 -7.5,6; 2 -7.5,5.5; 3 -7.5,5; 4 -7.5,4.5; 5 -7.5,4; 6 -7.5,3.5; 7 -7.5,3; 8 -7.5,2.5; 9 -7.5,2; 10 -7.5,1.5; 11 -7.5,1; 12 -7.5,0.5; 13 -7.5,0; 14 -7.5,-0.5; 15 -7.5,-1; 16 -7.5,-1.5; 17 -7.5,-2; 18 -7.5,-2.5; 19 -7.5,-3; 20 -7.5,-3.5; 21 -7.5,-4; 22 -7.5,-4.5; 23 -7.5,-5; 24 -7.5,-5.5; 25 -7.5,-6; 51 7.5,-6; 52 7.5,-5.5; 53 7.5,-5; 54 7.5,-4.5; 55 7.5,-4; 56 7.5,-3.5; 57 7.5,-3; 58 7.5,-2.5; 59 7.5,-2; 60 7.5,-1.5; 61 7.5,-1; 62 7.5,-0.5; 63 7.5,0; 64 7.5,0.5; 65 7.5,1; 66 7.5,1.5; 67 7.5,2; 68 7.5,2.5; 69 7.5,3; 70 7.5,3.5; 71 7.5,4; 72 7.5,4.5; 73 7.5,5; 74 7.5,5.5; 75 7.5,6 | smd 0.3 x 1.5: 26 -6,-7.5; 27 -5.5,-7.5; 28 -5,-7.5; 29 -4.5,-7.5; 30 -4,-7.5; 31 -3.5,-7.5; 32 -3,-7.5; 33 -2.5,-7.5; 34 -2,-7.5; 35 -1.5,-7.5; 36 -1,-7.5; 37 -0.5,-7.5; 38 0,-7.5; 39 0.5,-7.5; 40 1,-7.5; 41 1.5,-7.5; 42 2,-7.5; 43 2.5,-7.5; 44 3,-7.5; 45 3.5,-7.5; 46 4,-7.5; 47 4.5,-7.5; 48 5,-7.5; 49 5.5,-7.5; 50 6,-7.5; 76 6,7.5; 77 5.5,7.5; 78 5,7.5; 79 4.5,7.5; 80 4,7.5; 81 3.5,7.5; 82 3,7.5; 83 2.5,7.5; 84 2,7.5; 85 1.5,7.5; 86 1,7.5; 87 0.5,7.5; 88 0,7.5; 89 -0.5,7.5; 90 -1,7.5; 91 -1.5,7.5; 92 -2,7.5; 93 -2.5,7.5; 94 -3,7.5; 95 -3.5,7.5; 96 -4,7.5; 97 -4.5,7.5; 98 -5,7.5; 99 -5.5,7.5; 100 -6,7.5
DDC_R-PDSO-G5 = smd 0.6 x 0.8: 1 -0.95,-1.25; 2 0,-1.25; 3 0.95,-1.25; 4 0.95,1.25; 5 -0.95,1.25
S32 = drill 0.813: 1 1.27,5.08 | drill 0.813 octagon: 2 -1.27,7.62; 3 -1.27,5.08; 4 -3.81,7.62; 5 -6.35,5.08; 6 -3.81,5.08; 7 -6.35,2.54; 8 -3.81,2.54; 9 -6.35,0; 10 -3.81,0; 11 -6.35,-2.54; 12 -3.81,-2.54; 13 -6.35,-5.08; 14 -3.81,-7.62; 15 -3.81,-5.08; 16 -1.27,-7.62; 17 -1.27,-5.08; 18 1.27,-7.62; 19 1.27,-5.08; 20 3.81,-7.62; 21 6.35,-5.08; 22 3.81,-5.08; 23 6.35,-2.54; 24 3.81,-2.54; 25 6.35,0; 26 3.81,0; 27 6.35,2.54; 28 3.81,2.54; 29 6.35,5.08; 30 3.81,7.62; 31 3.81,5.08; 32 1.27,7.62
PDIP28 = drill 0.813 square: 1 -16.51,-7.62 | drill 0.813: 2 -13.97,-7.62; 3 -11.43,-7.62; 4 -8.89,-7.62; 5 -6.35,-7.62; 6 -3.81,-7.62; 7 -1.27,-7.62; 8 1.27,-7.62; 9 3.81,-7.62; 10 6.35,-7.62; 11 8.89,-7.62; 12 11.43,-7.62; 13 13.97,-7.62; 14 16.51,-7.62; 15 16.51,7.62; 16 13.97,7.62; 17 11.43,7.62; 18 8.89,7.62; 19 6.35,7.62; 20 3.81,7.62; 21 1.27,7.62; 22 -1.27,7.62; 23 -3.81,7.62; 24 -6.35,7.62; 25 -8.89,7.62; 26 -11.43,7.62; 27 -13.97,7.62; 28 -16.51,7.62
1X04 = drill 1.016 long: 1 -3.81,0; 2 -1.27,0; 3 1.27,0; 4 3.81,0
1X06_SMD = smd 1.27 x 1.27: GND 3.81,0; TCK 1.27,0; TDI -3.81,0; TDO -1.27,0; TMS -6.35,0; VCC 6.35,0
CRYSTAL-SMD-5X3 = smd 1.9 x 1.1: 1 -1.85,-1.15; 2 1.85,-1.15; 3 1.85,1.15; 4 -1.85,1.15
TP12SQ = smd 1.2 x 1.2: TP 0,0
SDIP-64-CONN = drill 0.711 square: 1 -27.559,-9.525 | drill 0.711: 2 -25.781,-9.525; 3 -24.003,-9.525; 4 -22.225,-9.525; 5 -20.447,-9.525; 6 -18.669,-9.525; 7 -16.891,-9.525; 8 -15.113,-9.525; 9 -13.335,-9.525; 10 -11.557,-9.525; 11 -9.779,-9.525; 12 -8.001,-9.525; 13 -6.223,-9.525; 14 -4.445,-9.525; 15 -2.667,-9.525; 16 -0.889,-9.525; 17 0.889,-9.525; 18 2.667,-9.525; 19 4.445,-9.525; 20 6.223,-9.525; 21 8.001,-9.525; 22 9.779,-9.525; 23 11.557,-9.525; 24 13.335,-9.525; 25 15.113,-9.525; 26 16.891,-9.525; 27 18.669,-9.525; 28 20.447,-9.525; 29 22.225,-9.525; 30 24.003,-9.525; 31 25.781,-9.525; 32 27.559,-9.525; 33 27.559,9.525; 34 25.781,9.525; 35 24.003,9.525; 36 22.225,9.525; 37 20.447,9.525; 38 18.669,9.525; 39 16.891,9.525; 40 15.113,9.525; 41 13.335,9.525; 42 11.557,9.525; 43 9.779,9.525; 44 8.001,9.525; 45 6.223,9.525; 46 4.445,9.525; 47 2.667,9.525; 48 0.889,9.525; 49 -0.889,9.525; 50 -2.667,9.525; 51 -4.445,9.525; 52 -6.223,9.525; 53 -8.001,9.525; 54 -9.779,9.525; 55 -11.557,9.525; 56 -13.335,9.525; 57 -15.113,9.525; 58 -16.891,9.525; 59 -18.669,9.525; 60 -20.447,9.525; 61 -22.225,9.525; 62 -24.003,9.525; 63 -25.781,9.525; 64 -27.559,9.525

### Placement (x,y rotation side)
C1  2.7,39.8 0 top
C2  19.85,40.15 180 top
C3  5.6,41.2 90 top
C102  31.2,17.3 270 bottom
C103  47.3,9.65 90 bottom
C104  18.65,38.15 0 bottom
C105  10,32.65 90 bottom
C106  11.35,32.65 90 bottom
C107  13,33.2 90 bottom
C108  14.25,32.75 90 bottom
C109  20,31.05 270 bottom
C110  21.35,31.05 270 bottom
C111  46.7,24.9 90 bottom
C112  38.7,25.45 90 bottom
C113  16.5,32.4 90 bottom
C114  17.95,32.4 90 bottom
C115  32.95,36.3 90 bottom
C116  13.3,24.55 270 bottom
C117  14.6,24.55 270 bottom
C118  16.15,24.55 270 bottom
C119  17.45,24.55 270 bottom
C120  20.05,24.1 270 bottom
C121  21.35,24.1 270 bottom
C122  10.1,25.3 90 bottom
C123  11.4,25.3 90 bottom
C124  1.9,18.45 180 bottom
C125  1.9,17 180 bottom
D1  27.6,30.9 0 bottom
D2  27.6,26.9 0 bottom
D3  31.55,26.9 0 bottom
D4  90.15,27.95 0 bottom
D5  90.15,30.95 0 bottom
D6  90.15,33.95 0 bottom
IC1  10.55,17.75 180 top
IC2  8.05,17.75 180 top
IC3  15.65,17.95 180 top
IC4  13.1,17.95 180 top
IC5  18.2,17.95 180 top
IC6  4.7,20.95 90 top
IC7  4.7,23.45 90 top
IC8  4.7,25.95 90 top
IC9  60.5,31.7 0 top
IC10  4.7,28.45 90 top
IC11  15.65,28.7 0 top
IC12  4.7,31 90 top
IC13  4.7,33.5 90 top
IC14  4.7,36 90 top
IC15  16.6,39.5 0 top
IC16  14.1,39.5 0 top
IC17  11.6,39.5 0 top
IC18  9.1,39.5 0 top
IC19  3.1,42.05 90 top
IC20A  57,9.35 90 top
IC20B  49.35,9.4 0 top
JP1  93.35,30.7 90 top
JP100  -0.2,29.25 90 bottom
Q100  42.69,25.17 0 bottom
R2  90.15,35.45 180 bottom
R3  90.15,32.45 180 bottom
R4  90.15,29.45 180 bottom
R107  8.85,21.15 180 bottom
TP_GND  22.95,39.85 0 top
TP_VCC  24.7,41.55 0 top
U1  60.5,29.05 0 top

### Tracks (layer width: path | path; a pad name or v marks a point on that pad's centre or on a via)
!D_HALT
  Top 0.178: IC9.51 U1.51
!D_INIT
  Top 0.178: IC11.81 19.15,37.05 20.75,38.65 25.85,38.65 27.6,36.9 36.1,36.9 36.95,37.75 52.85,37.75 53.4,38.3 53.4,40.35 IC9.52
!D_IRL
  Top 0.178: IC9.5 U1.5
!D_IRP  (via drill 0.33)
  Top 0.178: IC9.4 U1.4 | IC11.55 24.1,24.7 26.55,27.15 34.65,27.15 37.65,30.15 v38.05,30.15
  Bottom 0.178: 38.27,22.12 IC9.4 36.3,24.15 36.3,28.4 v38.05,30.15
!D_NMI
  Top 0.178: IC9.3 U1.3
!D_RD  (via drill 0.33)
  Top 0.178: IC11.83 18.15,37.05 20.1,39 26,39 27.75,37.25 35.38,37.25 v35.62,37.5 | v45.6,33.95 v42,33.95
  Bottom 0.178: IC9.10 48.9,22.22 48.9,28.65 48.05,29.5 48.05,31.5 v45.6,33.95 | v42,33.95 39.15,33.95 39.15,33.98 v35.62,37.5
!D_TEST
  Top 0.178: U1.49 IC9.49
!D_WDC
  Top 0.178: IC9.53 U1.53
!D_WI
  Top 0.178: IC9.50 U1.50
!D_WR  (via drill 0.33)
  Top 0.178: IC11.89 15.15,34.95 v15.45,34.6 | IC9.11 | v50.05,30.15 49.8,30.4 43.85,30.4 v43.6,30.15
  Bottom 0.178: v15.45,34.6 16.95,36.25 19.8,36.25 20.05,36 26.65,36 29.55,33.1 40.3,33.1 43.25,30.15 v43.6,30.15 | IC9.11 50.7,22.2 50.7,29.5 v50.05,30.15
!E_INIT  (via drill 0.33)
  Top 0.178: IC11.98 10.65,35.35 13,33 18,33 19.2,34.2 v19.2,34.95 | v30.35,34.55 v26.25,34.55
  Bottom 0.178: v19.2,34.95 25.85,34.95 v26.25,34.55 | U1.52 53.45,37.75 36.17,37.75 35.85,38.08 35.38,38.08 33.65,36.35 32.15,36.35 v30.35,34.55
!E_IS  (via drill 0.33)
  Top 0.178: IC11.54 24.1,24.2 26.7,26.8 34.8,26.8 37.2,29.2 48.75,29.2 v49,29.45
  Bottom 0.178: U1.10 49.85,20.43 49.85,22.6 50.35,23.1 50.35,28.1 v49,29.45
!E_OS  (via drill 0.33)
  Top 0.178: v49,33.5 48.7,33.2 36.7,33.2 33.45,29.95 24.35,29.95 24.1,29.7 IC11.65
  Bottom 0.152: 51.5,22.85 51.6,22.75
  Bottom 0.178: U1.11 51.6,20.4 51.6,22.75 | 51.5,22.85 51.5,23.4 51.75,23.65 51.75,30.75 v49,33.5
!M_RD  (via drill 0.33)
  Top 0.178: IC11.14 16.95,28.2 18.9,27.9 v21.6,26.7 | v48.5,9.4 48.5,16.6 IC20B.22 46.25,18.85 v46.25,21.1 | v31.6,24.05 38.5,24.05 39.5,23.05 40.45,23.05 40.95,22.55 40.95,21.9 41.5,21.35 42.45,21.35 v42.7,21.6
  Bottom 0.178: IC20A.24 57.23,10.85 53.9,10.85 52.45,9.4 v48.5,9.4 | v46.25,21.1 46,21.35 42.95,21.35 v42.7,21.6 | v31.6,24.05 31.35,23.8 22.4,25.9 v21.6,26.7
!M_ROM_CS  (via drill 0.33)
  Top 0.178: IC11.78 20.65,37.05 21.2,37.6 25.4,37.6 27.15,35.85 36.55,35.85 37.4,36.7 51.2,36.7 v51.7,36.2 | v53.9,10 53.9,10.9 52.85,11.95 52.85,15.95 53.15,16.25 53.15,17 IC20B.20 53.13,17.02 51.6,18.55 51.6,22.65 v52.1,23.15
  Bottom 0.178: IC20A.22 62.08,12.53 59.7,10.15 56.85,10.15 56.35,9.65 54.25,9.65 v53.9,10 | v51.7,36.2 52.1,35.8 v52.1,23.15
C_DRA0
  Top 0.178: IC11.30 11.65,18.05 11.35,17.75 10.95,17.75 10.55,17.35 IC1.5
C_DRA1
  Top 0.178: IC4.5 13.1,17.55 12.7,17.95 12.35,17.95 12,18.3 12,20.05 12.15,20.2 IC11.31
C_DRA2
  Top 0.178: IC3.5 15.65,17.55 15.25,17.95 14.9,17.95 14.35,18.5 14.35,19.5 13.9,19.95 13.55,19.95 13.15,20.35 IC11.33
C_DRA3
  Top 0.178: IC11.40 16.65,20.35 17.1,19.9 17.1,18.3 17.45,17.95 17.8,17.95 18.2,17.55 IC5.5
C_DRA4
  Top 0.178: IC15.5 16.6,39.9 16.2,39.5 15.7,39.5 15.35,39.15 15.35,37.5 15.65,37.2 17,37.2 17.15,37.05 IC11.85
C_DRA5
  Top 0.178: IC16.5 14.1,39.9 13.7,39.5 13.2,39.5 12.85,39.15 12.85,37.35 13.15,37.05 IC11.93
C_DRA6
  Top 0.178: IC17.5 11.6,39.9 11.2,39.5 10.7,39.5 10.35,39.15 10.35,37.5 10.65,37.2 11.5,37.2 11.65,37.05 IC11.96
C_DRA7
  Top 0.178: IC18.5 9.1,39.9 8.7,39.5 8.2,39.5 7.85,39.15 7.85,37.5 8.15,37.2 9.5,37.2 9.65,37.05 IC11.100
C_DRB0
  Top 0.178: IC11.28 10.65,20.35 10.5,20.2 10.4,20.2 9.3,19.1 9.3,18.25 8.8,17.75 8.45,17.75 8.05,17.35 IC2.5
C_DRB1
  Top 0.178: IC11.24 7.3,23.2 7.05,22.95 7.05,22.55 6.7,22.2 5.1,22.2 4.7,21.8 4.7,21.35 4.3,20.95 IC6.5
C_DRB2
  Top 0.178: IC11.20 7.3,25.2 6.8,24.7 5.1,24.7 4.7,24.3 4.7,23.85 4.3,23.45 IC7.5
C_DRB3
  Top 0.178: IC11.16 5.05,27.2 4.7,26.85 4.7,26.35 4.3,25.95 IC8.5
C_DRB4
  Top 0.178: IC11.10 7.35,30.2 6.7,29.55 4.7,29.55 4.7,28.45 IC10.5
C_DRB5
  Top 0.178: IC11.8 7.35,31.2 7.15,31 7.15,30.5 6.55,29.9 5.05,29.9 4.7,30.25 4.7,30.6 4.3,31 IC12.5
C_DRB6
  Top 0.178: IC11.6 7.3,32.2 7.25,32.25 4.8,32.25 4.7,32.9 4.7,33.1 4.3,33.5 IC13.5
C_DRB7
  Top 0.178: IC14.5 4.3,36 4.7,35.6 4.7,35.3 5.25,34.75 6.75,34.75 7.3,34.2 IC11.2
C_PA0
  Top 0.178: IC1.3 9.9,19.2 10.55,19.85 10.65,19.85 11.15,20.35 IC11.29
C_PA1
  Top 0.178: IC11.32 12.65,20.2 12.45,20 IC4.3
C_PA2
  Top 0.178: IC3.3 15,19.35 14.15,20.2 IC11.35
C_PA3
  Top 0.178: IC5.3 17.55,19.95 17.15,20.35 IC11.41
C_PA4
  Top 0.178: IC15.3 17.25,37.45 17.65,37.05 IC11.84
C_PA5
  Top 0.178: 13.65,36 IC11.92 13.65,37.05 13.8,37.2 14.45,37.2 14.75,37.5 IC16.3
C_PA6
  Top 0.178: 12.65,36.05 IC11.94 12.65,37.05 12.25,37.45 IC17.3
C_PA7
  Top 0.178: IC11.99 10.15,37.05 9.75,37.45 IC18.3
C_PB0
  Top 0.178: IC11.27 10.15,22.05 9.9,22.3 9.45,22.3 | 9.45,22.3 | 9.45,22.3 7.4,20.25 IC2.3
C_PB1
  Top 0.178: IC6.3 7.3,21.6 8.15,22.45 IC11.25
C_PB2
  Top 0.178: IC7.3 6.7,24.1 7.3,24.7 IC11.21
C_PB3
  Top 0.178: IC11.17 7.2,26.7 7.1,26.6 IC8.3
C_PB4
  Top 0.178: IC10.3 7.2,29.1 7.3,29.2 IC11.12
C_PB5
  Top 0.178: IC11.7 7.15,31.7 6.95,31.9 6.35,31.9 6.1,31.65 IC12.3
C_PB6
  Top 0.178: IC13.3 6.85,34.15 7.15,33.85 7.15,32.85 7.3,32.7 IC11.5
C_PB7
  Top 0.178: IC14.3 6.85,36.65 8.15,35.35 IC11.1
D1_XIN
  Bottom 0.254: C112.2 40.82,26.3 Q100.3 41.93,26.32 42.4,25.85 42.4,22.74 IC9.6
D1_XOUT
  Bottom 0.254: C111.1 44.57,24.05 Q100.1 43.47,24.02 43,23.55 43,22.78 IC9.7
D_A8  (via drill 0.33)
  Top 0.178: IC11.49 21.15,19.75 24.55,16.35 32.25,16.35 32.5,16.1 33.95,16.1 34.95,15.1 38.54,15.1 IC20B.25 | IC20A.27 54.45,18.55 55.15,19.25 55.15,22.7 v55.6,23.15 | v56.95,38 57.2,37.75 64.35,37.75 65.25,36.85 80.45,36.85 81.85,38.25 81.85,40.35 IC9.36
  Bottom 0.178: IC20A.27 54.45,14.4 55.35,13.5 55.35,12.8 54.45,11.9 48.05,11.9 47.05,12.9 44.8,12.9 40.68,17.02 IC20B.25 | v55.6,23.15 55.6,25.8 55.35,26.05 55.35,36.4 v56.95,38
D_A9  (via drill 0.33)
  Top 0.178: IC11.50 21.65,19.75 24.7,16.7 31.25,16.7 32.55,18 42.02,18 IC20B.24 45.9,14.12 v45.9,12.3 | IC20A.26 56.1,14.05 56.1,16.2 58.8,18.9 58.8,22.7 v58.35,23.15 | v82.8,36.8 81.8,35.8 58.4,35.8 v58.05,36.15
  Bottom 0.178: IC20A.26 57,12.25 55.95,11.2 53.75,11.2 52.3,9.75 49,9.75 48.7,10.05 48.3,10.05 47.9,9.65 46.3,9.65 45.7,10.25 45.7,12.1 v45.9,12.3 | IC9.35 83.6,40.32 83.6,37.6 v82.8,36.8 | v58.35,23.15 57.7,23.8 57.7,35.8 v58.05,36.15
D_A10  (via drill 0.33)
  Top 0.178: IC11.37 15.15,22.35 v15.3,22.5 | v22.4,20.95 22.4,19.5 24.85,17.05 31.1,17.05 32.4,18.35 42.95,18.35 v46.25,15.05 | IC20B.21 50.64,17 50.65,17 51,16.65 51,10.25 52.55,8.7 v52.9,8.7 | v59.2,11.2 v59.2,8.7 | IC9.34 85.4,40.34 85.4,38.3 84.85,37.75 81.85,37.75 80.6,36.5 64.45,36.5 v64.05,36.9
  Bottom 0.178: v15.3,22.5 16.6,21.2 22.15,21.2 v22.4,20.95 | v59.2,11.2 59.2,11.85 59.65,12.3 59.9,12.3 60.45,12.85 60.45,13.55 59.55,14.45 IC20A.23 60.8,15.7 62.3,17.2 62.3,35.15 v64.05,36.9 | v59.2,8.7 v52.9,8.7 | IC20B.21 50.62,15.62 49.8,14.8 46.5,14.8 v46.25,15.05
D_A11  (via drill 0.33)
  Top 0.178: IC11.36 14.65,22.2 v14.35,22.5 | v23,20.3 23,19.4 25,17.4 30.95,17.4 32.25,18.7 43.86,18.7 IC20B.23 47.55,15.01 v47.55,11.55 | v59.3,36.4 59.55,36.15 80.75,36.15 82,37.4 86.3,37.4 87.2,38.3 87.2,40.37 IC9.33
  Bottom 0.178: v14.35,22.5 16.05,20.8 21.55,20.8 22.05,20.3 v23,20.3 | v47.55,11.55 55.8,11.55 56.3,12.05 56.3,12.6 56.1,12.8 56.1,13.85 56.3,14.05 56.3,15 IC20A.25 57,17.65 58,18.65 58.2,18.65 58.8,19.25 58.8,22.65 59.15,23 59.15,36.25 v59.3,36.4
D_A12  (via drill 0.33)
  Top 0.178: IC20A.4 49.36,5.54 48.05,6.85 48.05,9 47.9,9.15 47.9,9.65 48.15,9.9 48.15,15.62 44.5,19.27 44.5,22.65 46.3,24.45 85.05,24.45 v86.25,23.25 | IC11.45 19.15,22 19.4,22.25 22,22.25 23.6,20.65 23.6,19.3 25.1,17.8 28.55,17.8 v28.75,18 | v31.45,12.5 31.8,12.5 35.38,8.92 IC20B.2
  Bottom 0.178: v86.25,23.25 86.25,22.21 IC9.31 | v28.75,18 28.75,17.4 32.2,13.95 32.55,13.95 32.9,13.6 32.9,13.1 32.3,12.5 v31.45,12.5 | IC20B.2 39.15,5.55 IC20A.4
D_A13  (via drill 0.33)
  Top 0.178: v50.4,18.5 49.85,19.05 49.85,22.6 51,23.75 81.95,23.75 82.45,23.25 v84.45,23.25 | IC11.46 19.65,20.3 19.8,20.15 19.8,19.6 24.1,15.3 31.8,15.3 32.05,15.05 33.5,15.05 35,13.55 v36.5,13.55
  Bottom 0.178: IC9.30 84.45,22.23 v84.45,23.25 | v36.5,13.55 37,14.05 37,16.1 IC20B.26 38.9,18 40.9,18 41.7,17.2 41.7,16.5 44.95,13.25 47.2,13.25 48.2,12.25 53.55,12.25 IC20A.28 54.46,13.19 53.55,14.1 53.55,16.1 54.05,16.6 54.05,17.4 52.95,18.5 v50.4,18.5
D_A14  (via drill 0.33)
  Top 0.178: IC20A.29 51.95,15.73 51.95,16.9 50.95,17.9 50.15,17.9 49.35,18.7 48.6,18.7 48.05,19.25 48.05,22.95 49.2,24.1 82.45,24.1 v82.7,23.85 | IC11.47 20.15,19.75 24.25,15.65 31.95,15.65 32.2,15.4 33.65,15.4 34.9,14.15 v35.95,14.15
  Bottom 0.178: IC20A.29 51.92,15.67 50.7,14.45 44.25,14.45 42.1,16.6 42.1,17.3 41.05,18.35 37.7,18.35 36.65,17.3 36.65,14.85 v35.95,14.15 | IC9.29 82.7,22.2 v82.7,23.85
D_A15  (via drill 0.33)
  Top 0.178: IC11.48 20.65,19.75 24.4,16 32.1,16 32.35,15.75 33.8,15.75 34.8,14.75 39.05,14.75 v40.1,15.8 | v63.55,6.45 65.05,6.45 66.2,7.6 66.2,8.8 v65.95,9.05
  Bottom 0.178: v40.1,15.8 41.4,15.8 45.35,11.85 45.35,8.45 47.35,6.45 v63.55,6.45 | IC9.28 80.95,21.5 81.85,20.6 81.85,19.25 81.25,18.65 68.85,18.65 66.2,16 66.2,9.3 v65.95,9.05
D_ADR  (via drill 0.33)
  Top 0.178: IC9.9 U1.9 | IC11.90 14.65,34.55 v14.75,34.65
  Bottom 0.178: IC9.9 48.05,23.09 48.05,28.4 46.9,29.55 43.35,29.55 40.15,32.75 29.4,32.75 26.5,35.65 19.9,35.65 19.65,35.9 16.35,35.9 v14.75,34.65
D_AL0  (via drill 0.33)
  Top 0.178: IC20A.12 59.59,5.54 60.85,6.8 60.85,13.7 61.5,14.35 61.5,15 61.2,15.3 61.2,16.15 v63.2,18.15 | v64.05,31.45 62.65,32.85 36.85,32.85 33.6,29.6 24.5,29.6 24.1,29.2 IC11.64
  Bottom 0.178: IC20B.10 55.7,3 56.95,4.25 58.25,4.25 IC20A.12 | v63.2,18.15 64.05,19 64.05,22.7 64.2,22.85 64.2,23.45 64.1,23.55 64.05,23.55 v64.05,31.45
D_AL1  (via drill 0.33)
  Top 0.178: IC20A.11 59.6,3 61.2,4.6 61.2,13.55 61.7,14.05 62.8,14.05 64.25,15.5 64.25,18.75 64.05,18.95 64.05,22.65 v63.55,23.15 | v63.2,31.45 62.15,32.5 37,32.5 33.75,29.25 24.65,29.25 24.1,28.7 IC11.63
  Bottom 0.178: IC20B.9 54.04,0.9 56.15,0.9 58.25,3 IC20A.11 | v63.55,23.15 63.55,31.1 v63.2,31.45
D_AL2  (via drill 0.33)
  Top 0.178: v18.7,22.6 18.7,22.15 18.65,22.1 IC11.44 | IC20B.8 49.75,2.65 44.85,2.65 v44.6,2.4 | v32.3,13.35 32.3,13 41.9,3.4 v42.9,3.4
  Bottom 0.178: v18.7,22.6 19.3,22 26.45,22 28.1,20.35 28.1,17.55 v32.3,13.35 | IC20B.8 51.93,1.78 54.3,4.15 55.61,4.15 IC20A.10 | v44.6,2.4 43.9,2.4 v42.9,3.4
D_AL3  (via drill 0.33)
  Top 0.178: IC11.42 17.65,22.05 v17.2,22.5 | v31.45,13.35 41.7,3.1 41.7,1.5 42.3,0.9 47.15,0.9 48.03,1.78 IC20B.7 48.96,0.9 53.6,0.9 55.7,3 IC20A.9
  Bottom 0.178: v17.2,22.5 18.1,21.6 26.35,21.6 27.75,20.2 27.75,17.4 31.45,13.7 v31.45,13.35
D_AL4  (via drill 0.33)
  Top 0.178: IC11.79 20.15,37.05 21.05,37.95 25.55,37.95 27.3,36.2 36.4,36.2 37.25,37.05 51.65,37.05 52.85,35.85 56.9,35.85 58.05,37 60.25,37 v60.5,36.75 | v57.65,14.25 57.9,14 57.9,10.55 54.46,7.11 IC20A.8
  Bottom 0.178: v57.65,14.25 57.9,14.5 57.9,16.05 57.35,16.6 57.35,17.4 58,18.05 59.3,18.05 60.5,19.25 v60.5,36.75 | IC20A.8 54.44,5.54 52.8,3.9 51.55,3.9 51,3.35 47.11,3.35 IC20B.6
D_AL5  (via drill 0.33)
  Top 0.178: IC11.80 19.65,37.05 20.9,38.3 25.7,38.3 27.45,36.55 36.25,36.55 37.1,37.4 55.95,37.4 v56.8,36.55 | v55.7,12.3 56.7,11.3 56.7,9.85 53.6,6.75 53.6,3.85 IC20A.7 53.15,3 52.25,2.1 51.6,2.1 50.7,3 44.22,3 IC20B.5
  Bottom 0.152: 56.85,24.75 56.85,23.7 57.15,23.4 57.15,22.9 56.95,22.7
  Bottom 0.178: v55.7,12.3 55.7,13.95 55.95,14.2 55.95,14.7 55.7,14.95 55.7,15.8 56.6,16.7 56.6,17.75 56.95,18.1 56.95,22.7 | 56.85,24.75 56.85,36.5 v56.8,36.55
D_AL6  (via drill 0.33)
  Top 0.178: IC20A.6 54.85,8.47 54.85,10.95 53.55,12.25 53.55,13.55 55.35,15.35 55.35,16.1 54.8,16.65 54.8,18.05 v55.15,18.4 | IC11.57 24.1,25.7 26.25,27.85 34.35,27.85 37.6,31.1 53.4,31.1 v54.25,30.25
  Bottom 0.178: IC20A.6 50.63,4.25 42.93,4.25 IC20B.4 | v54.25,30.25 54.25,23.55 55.15,22.65 v55.15,18.4
D_AL7  (via drill 0.33)
  Top 0.178: IC11.56 24.1,25.2 26.4,27.5 34.5,27.5 37.75,30.75 52.1,30.75 v53.1,29.75 | IC20A.5 51.9,3 51.05,3.85 51.05,5.9 51.55,6.4 52.3,6.4 54.5,8.6 54.5,10.8 53.2,12.1 53.2,15.75 54.05,16.6 54.05,17.4 53.4,18.05 v53.4,22.9
  Bottom 0.178: IC20A.5 48,3 45.9,0.9 38.8,0.9 IC20B.3 | v53.1,29.75 53.4,29.45 v53.4,22.9
D_ASR0
  Top 0.178: IC9.2 U1.2
D_ASR1
  Top 0.178: IC9.1 U1.1
D_ASR2
  Top 0.178: IC9.63 U1.63
D_ASR3
  Top 0.178: IC9.62 U1.62
D_CCLK  (via drill 0.33)
  Top 0.178: IC9.8 U1.8 | IC11.87 16.15,35.35 15.9,35.1 15.9,34.7 16.3,34.3 16.95,34.3 v17.6,34.95
  Bottom 0.178: IC9.8 46.36,23.15 47.45,23.15 47.7,23.4 47.7,28.25 46.75,29.2 43.2,29.2 40.05,32.35 29.3,32.35 26.35,35.3 19.75,35.3 19.5,35.55 18.2,35.55 v17.6,34.95
D_DA0  (via drill 0.33)
  Top 0.178: IC11.75 23.05,34.7 23,34.65 23.1,34.65 IC11.75 | IC20A.13 63.18,4.1 65.35,4.1 66.9,5.65 66.9,14.2 69.65,16.95 76.1,16.95 78.25,19.1 78.25,20.55 79.17,21.47 IC9.27 | IC11.75 25.25,34.7 26,33.95 30.57,33.95 31.42,34.8 37,34.8 37.85,35.65 49.2,35.65 50.1,34.75 71.8,34.75 73,33.55 78.8,33.55 v79.1,33.85
  Bottom 0.178: IC20B.11 59.53,1.78 60.75,3 IC20A.13 | IC9.27 79.15,22.19 79.15,33.8 v79.1,33.85
D_DA1  (via drill 0.33)
  Top 0.178: IC20A.14 66.55,7.47 66.55,14.35 69.5,17.3 74.7,17.3 76.5,19.1 76.5,20.55 77.39,21.44 IC9.26 | IC11.76 25.8,36.2 26.85,35.15 36.85,35.15 37.7,36 49.35,36 50.25,35.1 71.95,35.1 73.1,33.95 77,33.95 v77.2,34.15
  Bottom 0.178: IC20A.14 64.25,5.17 64.25,1.35 63.8,0.9 61.66,0.9 IC20B.12 | IC9.26 77.35,22.22 77.35,34 v77.2,34.15
D_DA2  (via drill 0.33)
  Top 0.178: IC11.77 21.15,37.05 21.35,37.25 25.25,37.25 27,35.5 36.7,35.5 37.55,36.35 49.55,36.35 50.45,35.45 74.95,35.45 v75.35,35.05 | IC9.25 75.61,21.46 74.75,20.6 74.75,19.1 73.3,17.65 69.35,17.65 66.2,14.5 66.2,10.45 65.15,9.4 63.95,9.4 62.95,8.4 62.95,6.41 IC20A.15
  Bottom 0.178: IC20A.15 63.32,4.3 IC20B.13 | IC9.25 75.6,34.8 v75.35,35.05
D_DA3  (via drill 0.33)
  Top 0.178: v63.35,10.65 62.08,9.38 IC20A.17 63.75,9.75 65,9.75 65.85,10.6 65.85,14.65 69.2,18 71.85,18 72.95,19.1 72.95,20.55 73.84,21.43 IC9.24 | IC11.60 24.1,27.2 25.45,28.55 34.05,28.55 37.3,31.8 61.5,31.8 62.8,30.5 73.15,30.5 v73.8,29.85
  Bottom 0.178: IC20B.15 65.85,17 65.85,13.15 v63.35,10.65 | IC9.24 73.8,22.21 v73.8,29.85
D_DA4  (via drill 0.33)
  Top 0.178: IC11.72 24.05,33.2 24.2,33.05 35.05,33.05 36.25,34.25 36.95,34.25 38,35.3 49.05,35.3 49.95,34.4 71.3,34.4 v71.85,33.85 | v63.2,15.3 63.35,15.45 63.35,16.99 IC20B.16 | v63.2,12.15 63.2,12.04 IC20A.18 64.62,11.88 63.75,12.75 63.75,13.9 64.85,15 65.7,15 69.05,18.35 70.4,18.35 71.15,19.1 71.15,20.55 72.06,21.46 IC9.23
  Bottom 0.178: v63.2,12.15 v63.2,15.3 | IC9.23 72.05,33.65 v71.85,33.85
D_DA5  (via drill 0.33)
  Top 0.178: IC11.71 35.2,32.7 36.4,33.9 37.1,33.9 38.15,34.95 48.9,34.95 50.05,33.8 v70.05,33.8 | IC20B.17 60.8,17 60.8,14.8 v60.55,14.55 | IC20A.19 62.1,10.64 62.1,11.9 63.35,13.15 63.35,14.05 64.65,15.35 65.55,15.35 69.4,19.2 69.4,20.55 70.28,21.43 IC9.22 | v59.9,9.2 v59.9,11.7
  Bottom 0.178: v60.55,14.55 60.8,14.3 60.8,12.6 v59.9,11.7 | v59.9,9.2 60.66,9.2 IC20A.19 | IC9.22 70.25,22.2 70.25,33.6 v70.05,33.8
D_DA6  (via drill 0.33)
  Top 0.178: v64.95,16 64.95,17.35 65.5,17.9 66.6,17.9 67.6,18.9 67.6,20.55 68.5,21.45 IC9.21 | v58.25,9.5 58.25,16.96 58.24,16.97 IC20B.18 | IC11.61 24.1,27.7 25.3,28.9 33.9,28.9 37.15,32.15 61.65,32.15 62.95,30.85 67.95,30.85 v68.2,31.1
  Bottom 0.178: IC20A.20 | v58.25,9.5 58.55,9.8 59.85,9.8 61.6,11.55 63.75,11.55 64.62,12.42 IC20A.20 | v68.2,31.1 68.5,30.8 IC9.21 | v64.95,16 64.95,14.2 64.6,13.85 64.6,13.18 IC20A.20
D_DA7  (via drill 0.33)
  Top 0.178: v65.85,18.5 65.85,21.25 66.72,22.12 IC9.20 | v56.1,10.25 55.1,11.25 55.1,12.55 55.35,12.8 v55.35,14.45 | IC11.58 24.1,26.2 26.1,28.2 34.2,28.2 37.45,31.45 55.75,31.45 v56.25,30.95 | IC20B.19 56.95,18.27 56.95,22.7 v56.5,23.15
  Bottom 0.178: IC20B.19 55.35,16.67 v55.35,14.45 | v65.85,18.5 65.85,18.3 63.55,16 62.4,16 62.1,15.7 IC20A.21 61.15,14.77 61.15,12.1 59.55,10.5 56.35,10.5 v56.1,10.25 | v56.5,23.15 56.5,30.7 v56.25,30.95
D_DOUT0
  Top 0.178: IC9.61 U1.61
D_DOUT1
  Top 0.178: IC9.60 U1.60
D_DOUT2
  Top 0.178: IC9.59 U1.59
D_DOUT3
  Top 0.178: IC9.58 U1.58
D_DOUT4
  Top 0.178: IC9.57 U1.57
D_DOUT5
  Top 0.178: IC9.56 U1.56
D_DOUT6
  Top 0.178: IC9.55 U1.55
D_DOUT7
  Top 0.178: IC9.54 U1.54
D_PA0  (via drill 0.33)
  Top 0.178: IC1.4 9.9,15.3 20.45,15.3 21.3,16.15 v21.3,17.2 | v25.55,18.4 25.55,20.4 30.85,25.7 35.2,25.7 37.65,28.15 82,28.15 v82.45,28.6
  Bottom 0.178: U1.36 82.2,38.05 82.2,28.85 v82.45,28.6 | v25.55,18.4 22.5,18.4 v21.3,17.2
D_PA1  (via drill 0.33)
  Top 0.178: IC4.4 12.45,15.65 20.3,15.65 20.7,16.05 v20.7,17.85 | v83.15,28.05 82.9,27.8 37.8,27.8 35.35,25.35 31,25.35 26.35,20.7 v26.35,18.75
  Bottom 0.178: U1.35 84.5,37.65 82.55,35.7 82.55,29.3 83.15,28.7 v83.15,28.05 | v26.35,18.75 26.1,19 21.85,19 v20.7,17.85
D_PA2  (via drill 0.33)  (1 unrouted)
  Top 0.178: v83.75,26.85 83.5,27.1 38.1,27.1 35.65,24.65 31.3,24.65 27.8,21.15 27.8,19.75 v27.15,19.1 | IC3.4 15,16 19.65,16
  Bottom 0.178: v27.15,19.1 26.9,19.35 20.1,19.35 | U1.34 86.28,37.03 83.75,34.5 v83.75,26.85
D_PA3  (via drill 0.33)  (1 unrouted)
  Top 0.178: v84.35,27.45 37.95,27.45 35.5,25 31.15,25 27.15,21 v27.15,19.95 | IC5.4 17.55,16.35 19.35,16.35
  Bottom 0.178: U1.33 88.06,38.31 84.35,34.6 v84.35,27.45 | 19.95,19.7 26.9,19.7 v27.15,19.95
D_PA4  (via drill 0.33)
  Top 0.178: IC15.4 17.55,42.2 17.75,42.4 74.45,42.4 v74.75,42.1
  Bottom 0.178: v74.75,42.1 75.95,42.1 76.5,41.55 76.5,40.85 76.95,40.4 77.8,40.4 78.3,40.9 78.3,41.7 78.6,42 78.6,42.65 78.95,43 80.4,43 81.85,41.55 81.85,27.4 84.3,24.95 85.85,24.95 87.15,23.65 87.15,21.35 86.28,20.48 U1.31
D_PA5  (via drill 0.33)
  Top 0.178: IC16.4 14.75,42.15 15.35,42.75 75.65,42.75 76.15,42.25 76.95,42.25 77.75,43.05 78.55,43.05 v79.25,42.35
  Bottom 0.178: U1.30 84.5,20.65 83.6,21.55 83.6,23.8 80.75,26.65 80.75,37.35 80.05,38.05 80.05,41.55 v79.25,42.35
D_PA6  (via drill 0.33)
  Top 0.178: IC17.4 11.95,42.15 12.9,43.1 75.8,43.1 76.3,42.6 76.8,42.6 77.6,43.4 79.1,43.4 80.05,42.45 80.05,37.8 v79.75,37.5
  Bottom 0.178: U1.29 82.73,20.43 81.8,21.35 81.8,25.1 80.4,26.5 80.4,36.85 v79.75,37.5
D_PA7  (via drill 0.33)
  Top 0.178: IC18.4 9.1,42.4 10.15,43.45 76.3,43.45 v76.55,43.2 | v78.85,37.5 78.3,38.05 78.3,42.05 v78,42.35
  Bottom 0.178: U1.28 80.95,20.7 80.05,21.6 80.05,36.3 v78.85,37.5 | v78,42.35 77.4,42.35 v76.55,43.2
D_PB0  (via drill 0.33)
  Top 0.178: IC2.4 7.4,16.35 6.25,15.45 v5.15,15.45 | v3.75,16.2 2.25,17.7 v2.85,21.1
  Bottom 0.178: v2.85,21.1 4.15,20.8 4.15,39.4 20.05,39.4 21.4,40.75 24.65,40.75 27.25,38.15 30.8,38.15 32.35,39.7 64.85,39.7 65.15,39.4 77.75,39.4 78.25,38.9 78.25,21.7 79.17,20.78 U1.27 | v3.75,16.2 4.5,15.45 v5.15,15.45
D_PB1  (via drill 0.33)
  Top 0.178: v2.85,22.05 3.2,21.7 IC6.4 | v76.5,37.5 76.5,39.67 v76.2,39.98
  Bottom 0.178: v2.85,22.05 3.8,21.4 3.8,39.75 19.95,39.75 21.25,41.1 24.8,41.1 27.4,38.5 30.65,38.5 32.2,40.05 65,40.05 65.3,39.75 75.98,39.75 v76.2,39.98 | U1.26 77.39,20.46 76.5,21.35 76.5,32.7 76.3,32.9 76.3,37.3 v76.5,37.5
D_PB2  (via drill 0.33)
  Top 0.178: v2.9,24.1 IC7.4 | v74.75,37.5 74.75,40.02 v74.45,40.33
  Bottom 0.178: v2.9,24.1 3.45,24.65 3.45,40.1 19.85,40.1 21.1,41.45 24.95,41.45 27.55,38.85 30.5,38.85 32.05,40.4 65.15,40.4 65.45,40.1 74.23,40.1 v74.45,40.33 | U1.25 75.61,20.54 74.75,21.4 74.75,30.35 74.4,30.7 74.4,37.15 v74.75,37.5
D_PB3  (via drill 0.33)
  Top 0.178: v2.85,26.6 IC8.4 | v72.95,37.5 v72.95,40.67
  Bottom 0.152: U1.24 73.84,20.46 72.95,21.35
  Bottom 0.178: v2.85,26.6 3.1,26.85 3.1,40.45 19.75,40.45 20.95,41.8 25.1,41.8 26.1,40.8 29.15,40.8 29.5,41.15 29.5,42.15 30.8,43.45 71.15,43.45 72.95,41.65 v72.95,40.67 | 72.95,21.35 72.95,29.05 72.75,29.25 72.75,30.5 72.95,30.7 v72.95,37.5
D_PB4  (via drill 0.33)
  Top 0.178: v2.5,29.1 IC10.4 | v71.15,37.5 v71.15,40.67 | v27.75,39.5 27.75,40 v26.35,41.4
  Bottom 0.152: U1.23 72.06,20.64
  Bottom 0.178: v2.5,29.1 2.75,29.35 2.75,40.8 19.65,40.8 20.8,42.15 25.6,42.15 v26.35,41.4 | 72.06,20.64 71.15,21.55 71.15,32.95 70.95,33.15 70.95,37.3 v71.15,37.5 | v71.15,40.67 71.15,41.65 69.7,43.1 30.95,43.1 29.85,42 29.85,40.95 29.35,40.45 28.7,40.45 v27.75,39.5
D_PB5  (via drill 0.33)
  Top 0.178: v2.15,31.65 IC12.4 | v69.4,37.5 v69.4,40.67 | v28.6,39.5 28.6,40 v27.2,41.4
  Bottom 0.152: 70.28,20.52 U1.22
  Bottom 0.178: v2.15,31.65 2.4,31.9 2.4,39.9 5,42.5 26.1,42.5 v27.2,41.4 | 70.28,20.52 69.4,21.4 69.4,32.35 68.75,33 68.75,36.85 v69.4,37.5 | v69.4,40.67 69.4,41.65 68.3,42.75 31.1,42.75 30.2,41.85 30.2,40.75 29.55,40.1 29.2,40.1 v28.6,39.5
D_PB6  (via drill 0.33)
  Top 0.178: v1.8,34.15 IC13.4 | v67.6,37.5 v67.6,40.67 | v29.45,39.5 29.45,40 v28.05,41.4
  Bottom 0.152: 68.5,20.75 U1.21
  Bottom 0.178: v1.8,34.15 2.05,34.4 2.05,40.1 4.8,42.85 26.6,42.85 v28.05,41.4 | 68.5,20.75 67.6,21.65 67.6,29.75 67,30.35 67,36.9 v67.6,37.5 | v67.6,40.67 67.6,41.75 66.95,42.4 31.25,42.4 30.55,41.7 30.55,40.6 v29.45,39.5
D_PB7  (via drill 0.33)
  Top 0.178: v1.45,36.65 IC14.4 | v65.85,37.5 v65.85,40.67 | v30.3,39.5 30.3,40 v28.9,41.4
  Bottom 0.152: 66.72,20.68 U1.20
  Bottom 0.178: v1.45,36.65 1.7,36.9 1.7,40.3 4.6,43.2 27.1,43.2 v28.9,41.4 | 66.72,20.68 65.85,21.55 v65.85,37.5 | v65.85,40.67 65.85,41.7 65.5,42.05 31.4,42.05 30.9,41.55 30.9,40.1 v30.3,39.5
D_PC0
  Top 0.178: U1.48 IC9.48
D_PC1
  Top 0.178: U1.47 IC9.47
D_PC2
  Top 0.178: U1.46 IC9.46
D_PC3
  Top 0.178: U1.45 IC9.45
D_PC4
  Top 0.178: U1.44 IC9.44
D_PC5
  Top 0.178: U1.43 IC9.43
D_PC6
  Top 0.178: U1.42 IC9.42
D_PC7
  Top 0.178: U1.41 IC9.41
D_PD0
  Top 0.178: U1.40 IC9.40
D_PD1
  Top 0.178: U1.39 IC9.39
D_PD2
  Top 0.178: U1.38 IC9.38
D_PD3
  Bottom 0.178: U1.37 IC9.37
D_SCLK
  Top 0.178: IC9.13 U1.13
  Bottom 0.178: U1.13
D_SIN0
  Bottom 0.178: IC9.17 U1.17
D_SIN1
  Bottom 0.178: IC9.16 U1.16
D_SIN2
  Bottom 0.178: IC9.15 U1.15
D_SIN3
  Bottom 0.178: IC9.14 U1.14
D_SOUT0
  Bottom 0.178: IC9.19 U1.19
D_SOUT1
  Bottom 0.178: IC9.18 U1.18
GND  (via drill 0.3)  (41 unrouted)
  Top 0.254: IC11.95 12.15,34.95 | IC11.86 16.65,35.05 | IC11.11 9.35,29.7 | IC12.2 6,31 6.35,31.35 v6.7,31.35 | IC13.2 6.5,33.5 v6.6,33.6 | IC6.2 6.35,20.95 v6.45,21.05 | IC7.2 6.35,23.45 v6.45,23.55 | IC8.2 6.35,25.95 v6.45,26.05 | IC10.2 6.35,28.45 v6.45,28.55 | IC14.2 6.5,36 v6.6,36.1 | IC2.2 8.05,19.4 v7.95,19.5 7.95,20 9.15,21.2 IC11.26 | IC1.2 10.55,18.15 v10.15,17.75 | IC4.2 13.1,19.6 v13,19.7 | IC3.2 v15.65,19.75 IC11.38 | IC5.2 18.2,19.6 v18.1,19.7 18.15,19.75 IC11.43 | IC18.2 9.1,37.85 v9.2,37.75 | IC17.2 11.6,37.85 v11.7,37.75 | IC16.2 14.1,37.85 v14.2,37.75 | IC15.2 16.6,37.85 v16.7,37.75
  Bottom 0.254: C112.1 37.95,24.6
  pour GND: -3.15,47 -3.15,-1.4 99.05,-1.4 99.05,47
M_A15  (via drill 0.33)
  Top 0.178: v49.6,17.6 49.75,17.45 49.75,16.65 50.65,15.75 50.65,9.35 IC20A.3 | v34.05,31.4 33.5,31.95 29.3,31.95 28.85,31.5 28.35,31.5 28.15,31.7 IC11.69
  Bottom 0.178: v49.6,17.6 48.85,18.35 45.42,18.35 44.5,19.27 44.5,19.9 44.05,20.35 42.7,20.35 42.35,20.7 38.55,20.7 37.4,21.85 37.4,22.55 35.95,24 35.95,29.5 v34.05,31.4
M_A16  (via drill 0.33)
  Top 0.178: IC20A.2 50.3,9 50.3,15.35 v49.15,16.5 | IC11.68 28.15,31.2 28.2,31.15 29,31.15 29.15,31.3 33,31.3 v33.5,30.8
  Bottom 0.178: v49.15,16.5 49.15,17.2 48.35,18 44,18 42.75,19.25 42.75,19.8 42.2,20.35 37.15,20.35 35.6,21.9 35.6,28.7 v33.5,30.8
M_A17/M_A14  (via drill 0.33)
  Top 0.178: IC20A.30 49.4,13.18 v49.4,15.4 | v32.15,30.7 IC11.67
  Bottom 0.178: v49.4,15.4 48.65,16.15 45.15,16.15 42.6,18.7 37.05,18.7 IC20B.27 35.38,18.78 35.6,19 35.6,20.05 33.9,21.75 33.9,28.95 v32.15,30.7
MSEL0  (via drill 0.33)
  Top 0.178: IC11.52 24.95,23.2 27.6,25.85 v29.55,25.85 29.75,26.05 35.05,26.05 37.5,28.5 81.55,28.5 82.75,29.7 85.65,29.7 v85.9,29.45
  Bottom 0.178: D4.2 R4.1 v85.9,29.45 | 29.55,26.1 v29.55,25.85 29.55,26.7 30.85,28 D3.3
MSEL0_ECU
  Bottom 0.178: R4.2 93.35,29.45 JP1.2
MSEL1  (via drill 0.33)
  Top 0.178: IC11.53 24.6,23.7 v25.5,24.6 27.35,26.45 34.95,26.45 37.35,28.85 81.4,28.85 82.6,30.05 v86.5,30.05
  Bottom 0.178: R3.1 D5.2 87.4,30.95 v86.5,30.05 | D2.3 26.4,28 25.5,27.1 v25.5,24.6
MSEL1_ECU
  Bottom 0.178: R3.2 91.55,32.45 92.1,33 93.15,33 93.35,32.8 JP1.3
MSEL2  (via drill 0.33)
  Top 0.178: v86.3,35.45 84.05,33.2 50.15,33.2 48.75,34.6 38.3,34.6 37.25,33.55 36.55,33.55 35.35,32.35 28.85,32.35 v28.6,32.1 28.5,32.2 IC11.70
  Bottom 0.178: D6.2 R2.1 v86.3,35.45 | v28.6,32.1 28.5,32 D1.3
MSEL2_ECU
  Bottom 0.178: R2.2 92.1,35.45 92.25,35.6 93.1,35.6 93.35,35.35 JP1.4
TCK  (1 unrouted)
  Top 0.178: IC11.62 22.05,28.2 21.95,28.1
TDI  (1 unrouted)
  Top 0.178: 9.05,33.2 IC11.4
TDO  (1 unrouted)
  Top 0.178: IC11.73 22.25,33.7 21.5,32.95 21.5,31.05
TMS  (via drill 0.3)  (2 unrouted)
  Top 0.178: IC11.15 8.95,27.7 9,27.65 9.45,27.65 | v4.7,22.9 4.7,22.35
  Bottom 0.178: R107.1 5.55,22.05 v4.7,22.9
VCC  (30 unrouted)
VCC_CPLD  (via drill 0.3)  (25 unrouted)
  Top 0.254: IC11.34 v13.65,22.4 | v16.15,22.45 IC11.39 16.15,20.1 16.3,19.95 IC3.1 v16.3,17.95 | IC13.1 6.55,32.85 v6.6,32.8 | IC12.1 6.2,30.35 v6.45,30.6 | IC8.1 6.4,25.3 v6.45,25.25 | IC7.1 6.4,22.8 v6.45,22.75 | IC6.1 6.4,20.3 v6.45,20.25 | IC10.1 6.4,27.8 v6.45,27.75 | IC14.1 6.55,35.35 v6.6,35.3 | IC2.1 8.7,19.45 v8.75,19.5 | IC1.1 11.2,19.3 v11.05,19.45 | IC4.1 v13.75,17.95 | IC5.1 18.85,19.65 v18.9,19.7 | IC18.1 8.45,37.8 v8.4,37.75 | IC17.1 10.95,37.8 v10.9,37.75 | IC15.1 15.95,37.8 v15.9,37.75 | IC16.1 13.45,37.8 v13.4,37.75 | IC11.51 22.3,22.7 21.9,23.1
  Bottom 0.254: v13.65,22.4 13.3,22.75 C116.2 C117.2 | v16.15,22.45 C118.2 C119.2 | 9.35,26.15 C122.2 C123.2 | C120.2 C121.2
  pour Supply: 5.85,38.3 5.85,18.75 5.85,18.6 7.05,17.4 19.25,17.4 20.6,18.75 23.9,18.75 23.9,38.3

### Text on the board
tPlace: 2 | 1 | 0 | GND | GND | ToyoTune LVC 2.0 | Copyright 2016, Powertrain Logic LLP | 16 | 12
bPlace: VCC | GND | TCK | TDO | TDI | TMS